# EAGLE design Corner Board Rev4updated (EAGLE 9.6.2)

## Sheet 1 of 3
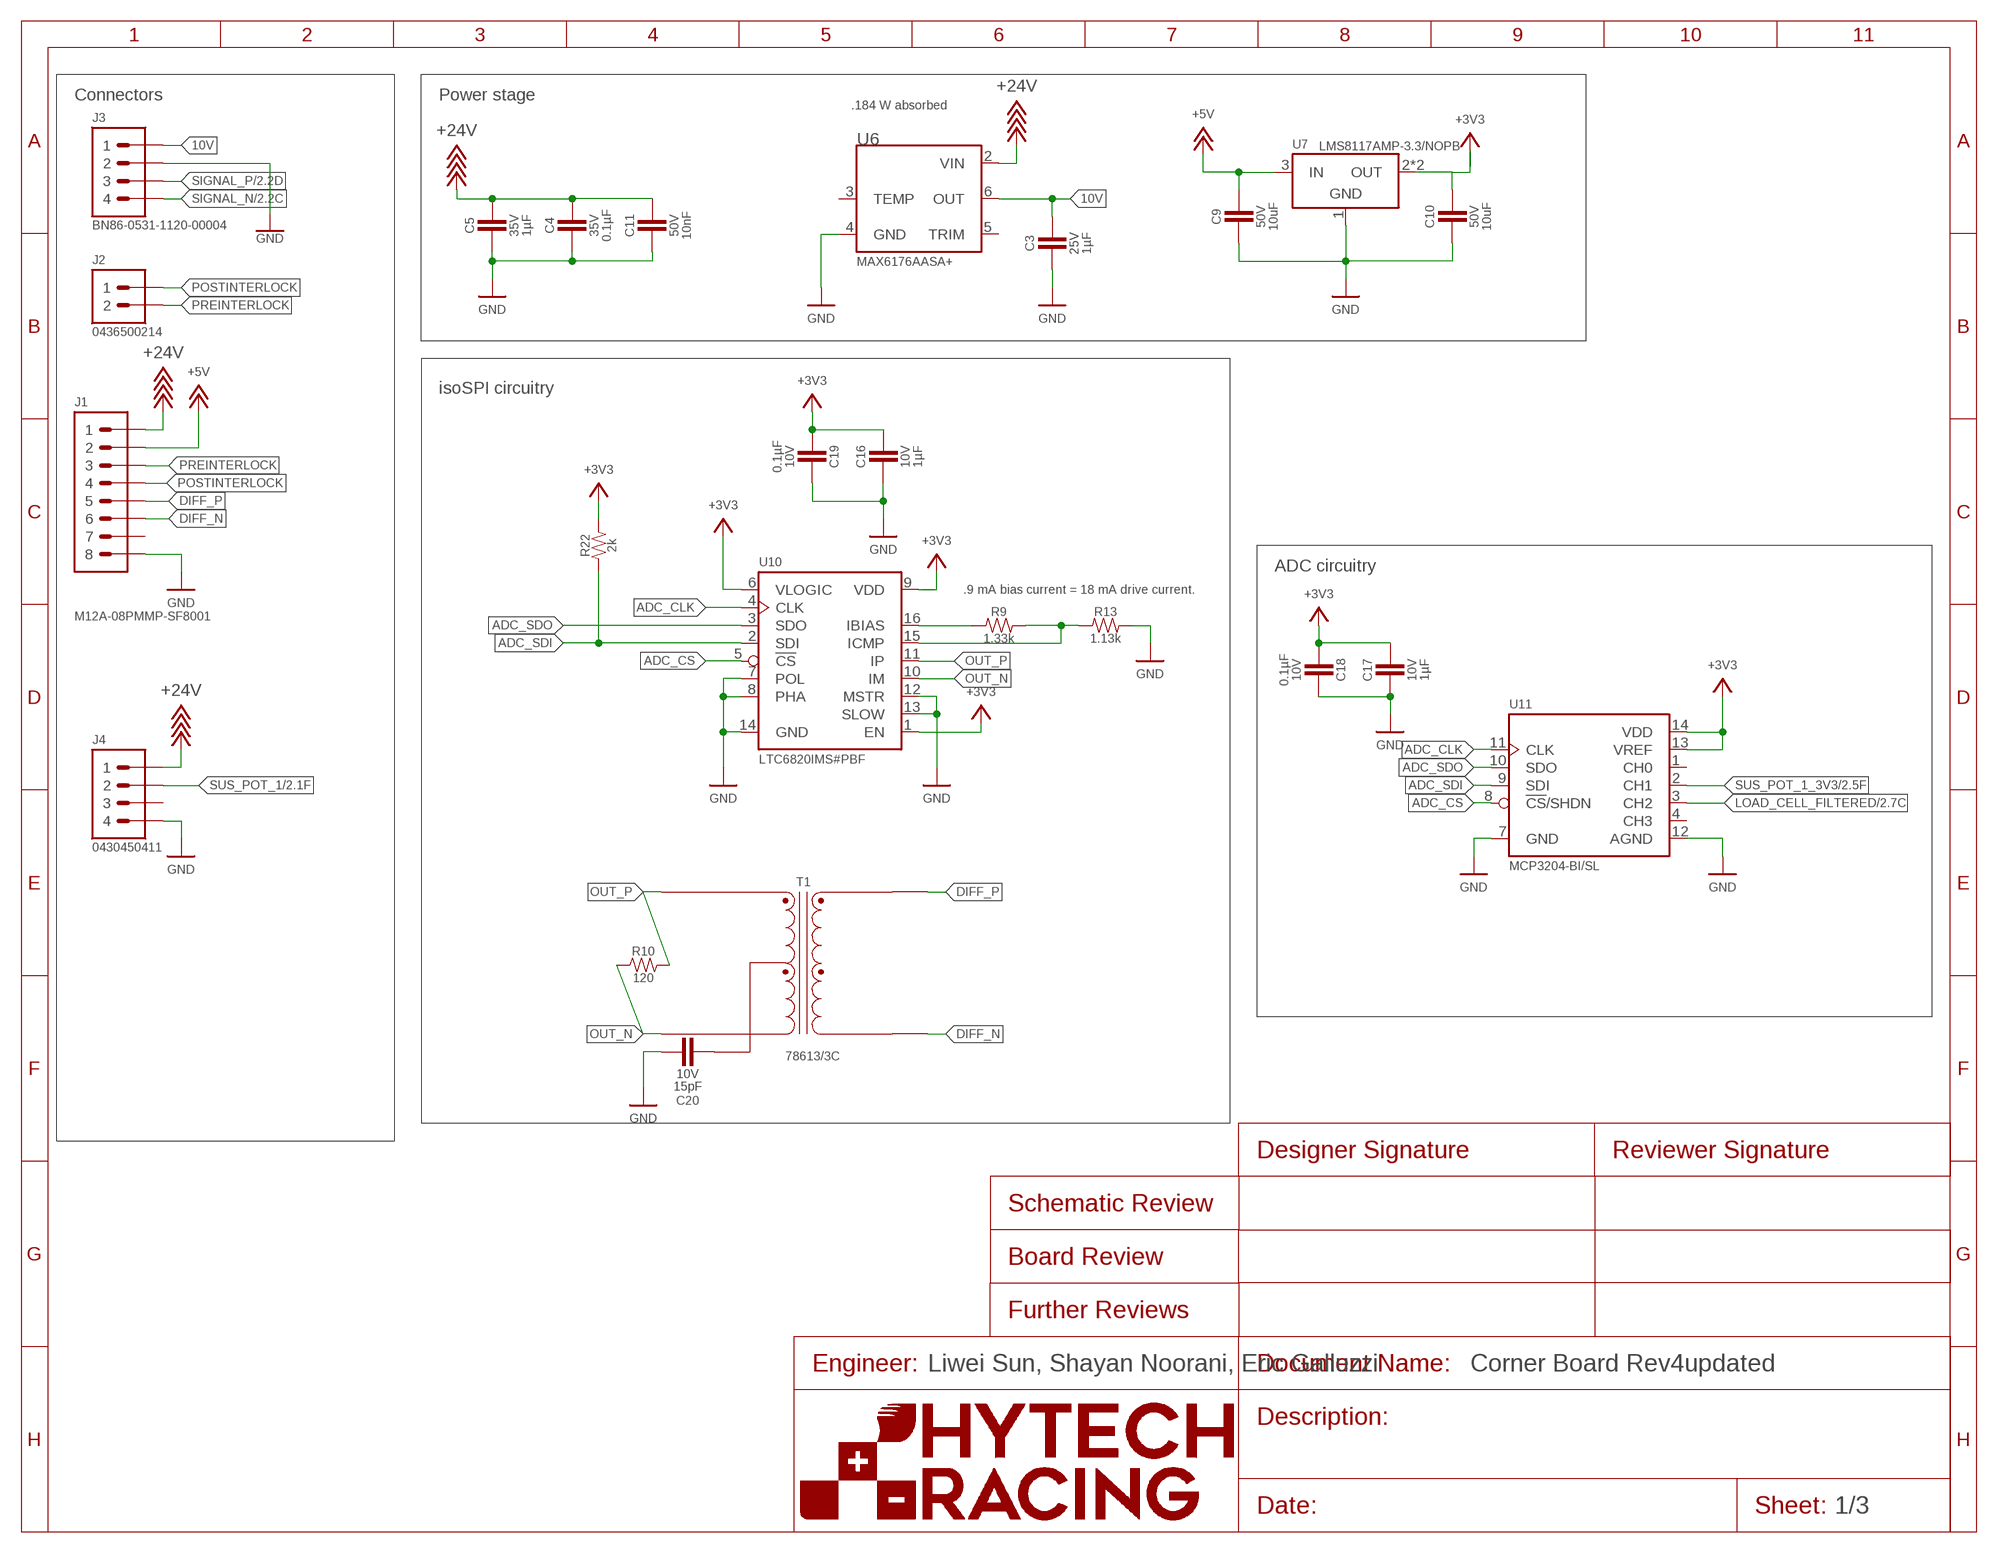
[diagram p0: schematic, sheet 1]
FRAME1 (FRAME): ENGINEER: Liwei Sun, Shayan Noorani, Eric Galluzzi

### Parts
C3  CAPACITOR_0603_25V_1UF  [0603-CAP]
C4  CAPACITOR_0603_35V_0.1UF  [0603-CAP]
C5  CAPACITOR_0603_35V_1UF  [0603-CAP]
C9  CAPACITOR_0805_50V_10UF  [0805-CAP]
C10  CAPACITOR_0805_50V_10UF  [0805-CAP]
C11  CAPACITOR_0603_50V_10NF  [0603-CAP]
C16  CAPACITOR_0603_10V_1UF  [0603-CAP]
C17  CAPACITOR_0603_10V_1UF  [0603-CAP]
C18  CAPACITOR_0603_10V_0.1UF  [0603-CAP]
C19  CAPACITOR_0603_10V_0.1UF  [0603-CAP]
C20  CAPACITOR_0603_10V_15PF  [0603-CAP]
J1  CONNECTOR-8_AMPHENOL_M12A_08PMMP_  [M12A-08PMMP]
J2  CONNECTOR-2_MICROFIT_SMD_RIGHTANGLE_02_SINGLE_BLACK  [MOLEX_MICROFIT_SMD_RIGHTANGLE_02_SINGLE]
J3  BINDER-M12-A_4_PIN  [BINDER-86-0531-1120-00004M12]
J4  CONNECTOR-4_μF_S_RA_  [MOLEX_MICROFIT_SMD_RIGHTANGLE_04_DUAL]
R9  RESISTOR_0603_1.33K  [0603-RES]
R10  RESISTOR_0603_120  [0603-RES]
R13  RESISTOR_0603_1.13K  [0603-RES]
R22  RESISTOR_0603_2K  [0603-RES]
T1  78613/3C_78613/3C_AIRGAP  [78613/3C_AIRGAP]
U6  VOLTAGE_REFERENCE_SOIC-8_10V  [SOIC-08(NARROW,0.15")]
U7  VOLTAGE_REGULATOR_SOT-223_3.3V  [SOT-223]
U10  LTC6820  [MSOP-16]
U11  MCP3204  [SOIC-14]

### Nets
10V: C3.1 J3.1 U6.6(OUT)
+3V3: C10.1 C16.1 C17.1 C18.2 C19.2 R22.2 U7.2(OUT) U7.4(OUT) U10.1(EN) U10.6(VLOGIC) U10.9(VDD) U11.13(VREF) U11.14(VDD) ; also sheet 2
+5V: C9.1 J1.2 U7.3(IN)
+24V: C4.1 C5.1 C11.1 J1.1 J4.1 U6.2(VIN) ; also sheet 2
ADC_CLK: U10.4(CLK) U11.11(CLK)
ADC_CS: U10.5(!CS) U11.8(!CS!/SHDN)
ADC_SDI: R22.1 U10.2(SDI) U11.9(SDI)
ADC_SDO: U10.3(SDO) U11.10(SDO)
DIFF_N: J1.6 T1.4(SEC_1)
DIFF_P: J1.5 T1.6(SEC_2)
GND: C3.2 C4.2 C5.2 C9.2 C10.2 C11.2 C16.2 C17.2 C18.1 C19.1 C20.2 J1.8 J3.2 J4.4 R13.2 U6.4(GND) U7.1(GND) U10.7(POL) U10.8(PHA) U10.12(MSTR) U10.13(SLOW) U10.14(GND) U11.7(GND) U11.12(AGND) ; also sheet 2
LOAD_CELL_FILTERED: U11.3(CH2) ; also sheet 2
N$14: C20.1 T1.2(PRI_CENTER_TAP)
N$16: R9.1 U10.16(IBIAS)
N$17: R9.2 R13.1 U10.15(ICMP)
OUT_N: R10.1 T1.3(PRI_2) U10.10(IM)
OUT_P: R10.2 T1.1(PRI_1) U10.11(IP)
POSTINTERLOCK: J1.4 J2.1
PREINTERLOCK: J1.3 J2.2
SIGNAL_N: J3.4 ; also sheet 2
SIGNAL_P: J3.3 ; also sheet 2
SUS_POT_1: J4.2 ; also sheet 2
SUS_POT_1_3V3: U11.2(CH1) ; also sheet 2
Unconnected: J1.7 J4.3 U6.3(TEMP) U6.5(TRIM) U11.1(CH0) U11.4(CH3)

### Notes on the sheet
- Connectors | Power stage
- .184 W absorbed
- isoSPI circuitry
- ADC circuitry
- .9 mA bias current = 18 mA drive current.

## Sheet 2 of 3: Signal Aq
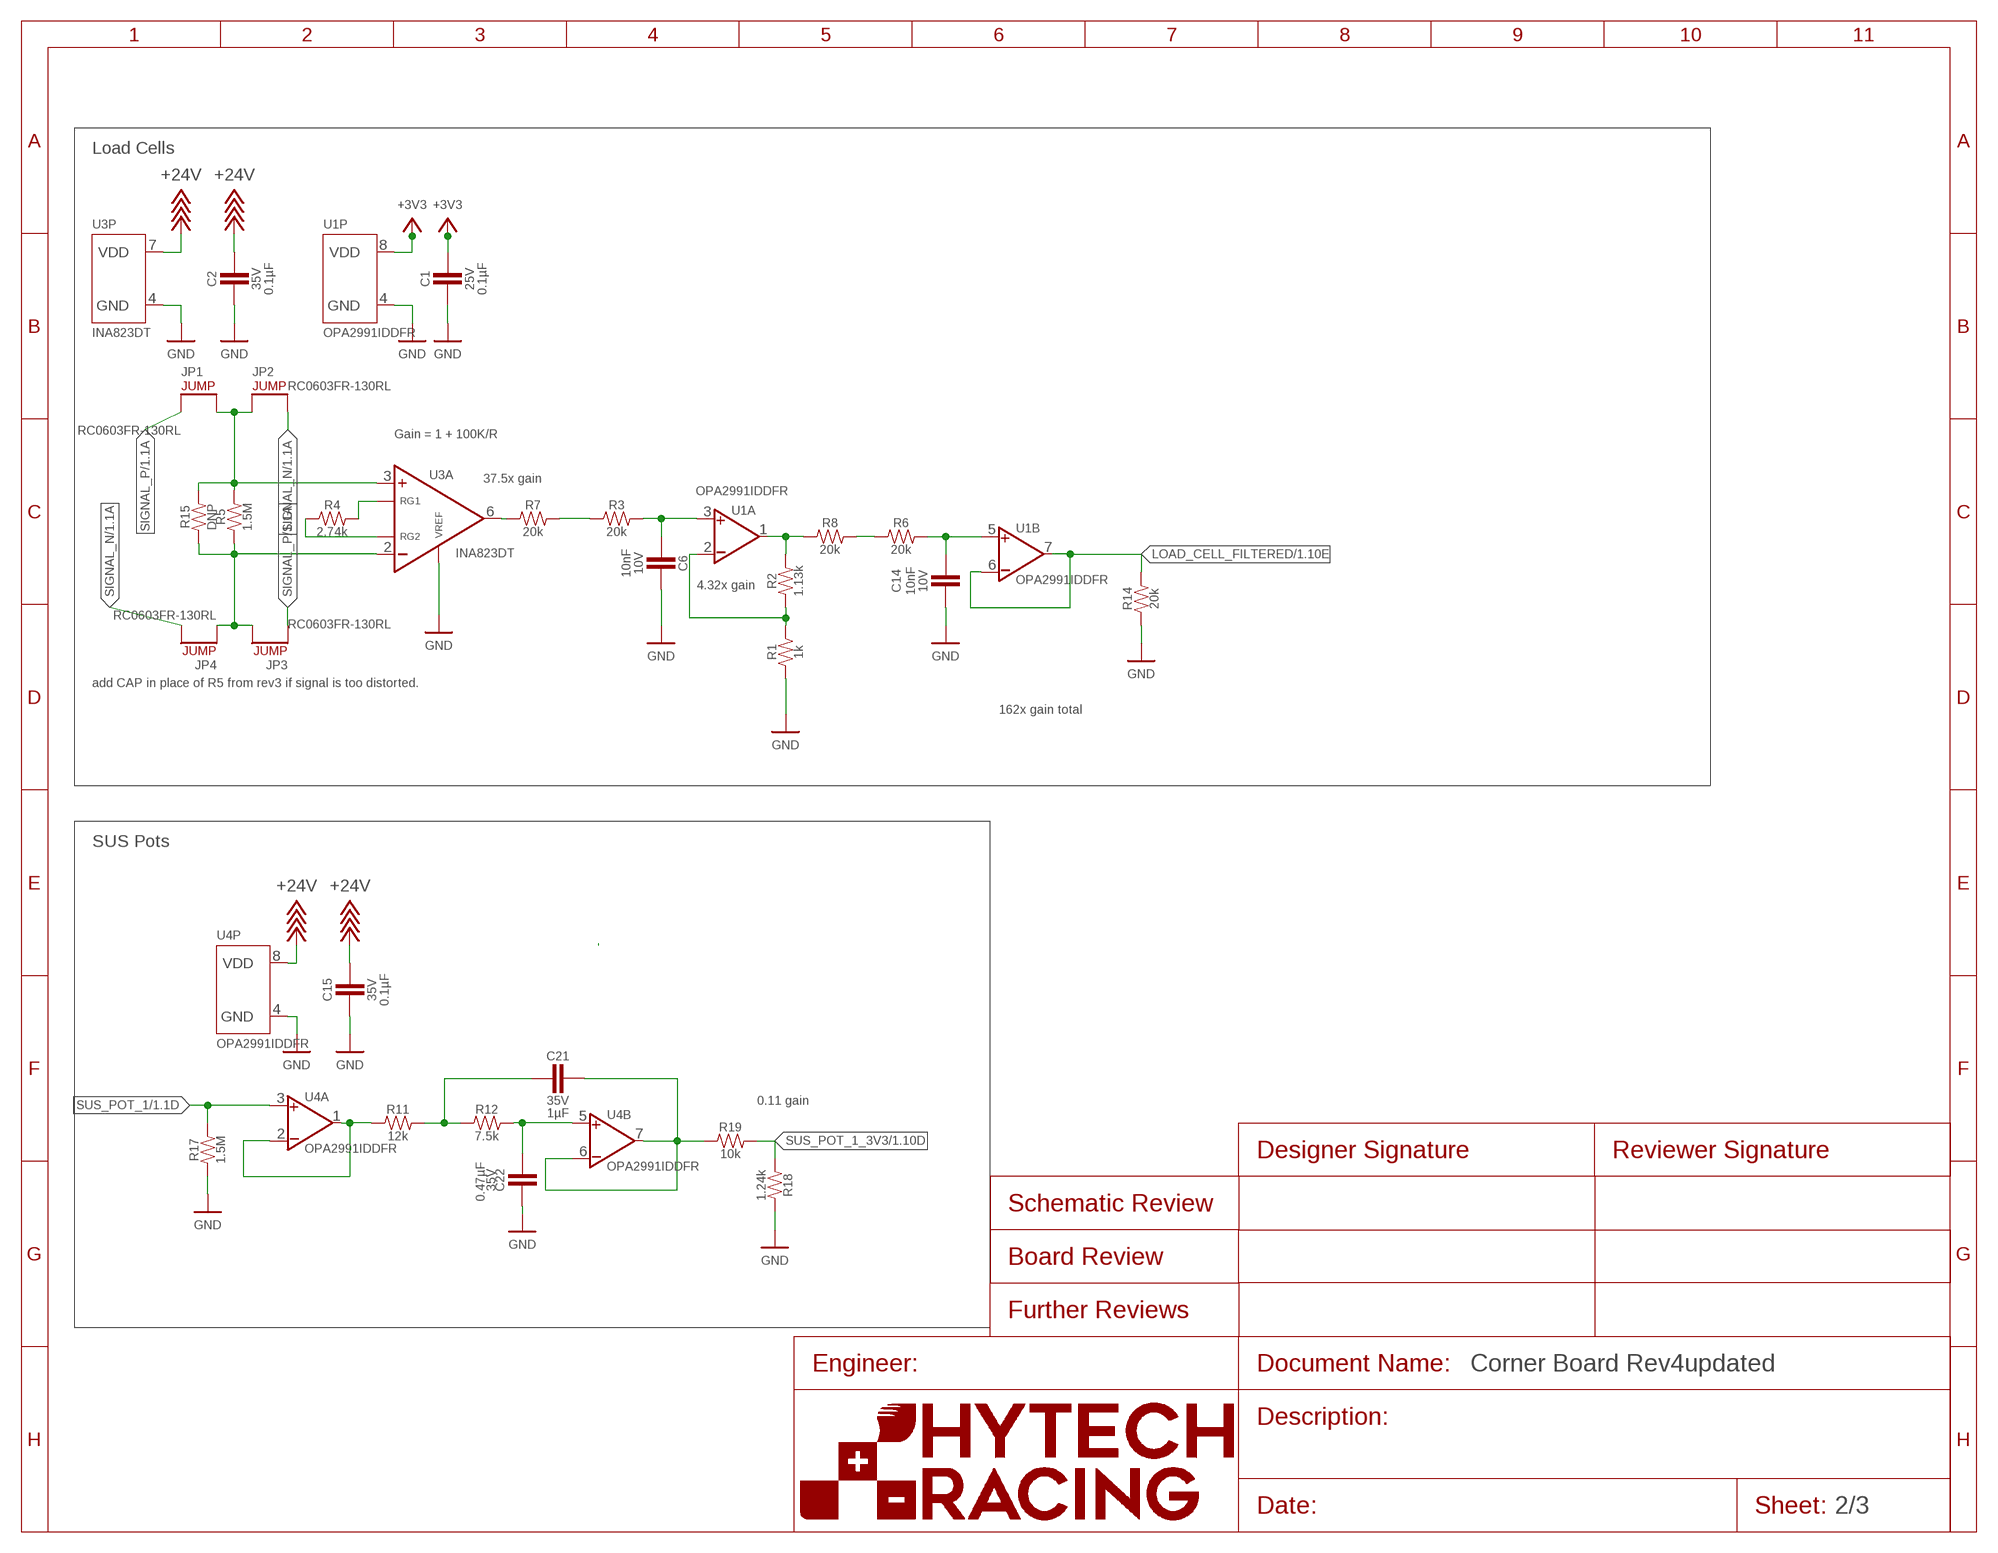
[diagram p1: schematic, sheet 2]

### Parts
C1  CAPACITOR_0603_25V_0.1UF  [0603-CAP]
C2  CAPACITOR_0603_35V_0.1UF  [0603-CAP]
C6  CAPACITOR_0603_10V_10NF  [0603-CAP]
C14  CAPACITOR_0603_10V_10NF  [0603-CAP]
C15  CAPACITOR_0603_35V_0.1UF  [0603-CAP]
C21  CAPACITOR_0603_35V_1UF  [0603-CAP]
C22  CAPACITOR_0603_35V_0.47UF  [0603-CAP]
JP1  JUMPER_0603_  [0603-RES]
JP2  JUMPER_0603_  [0603-RES]
JP3  JUMPER_0603_  [0603-RES]
JP4  JUMPER_0603_  [0603-RES]
R1  RESISTOR_0603_1K  [0603-RES]
R2  RESISTOR_0603_1.13K  [0603-RES]
R3  RESISTOR_0603_20K  [0603-RES]
R4  RESISTOR_0603_2.74K  [0603-RES]
R5  RESISTOR_0603_1.5M  [0603-RES]
R6  RESISTOR_0603_20K  [0603-RES]
R7  RESISTOR_0603_20K  [0603-RES]
R8  RESISTOR_0603_20K  [0603-RES]
R11  RESISTOR_0603_12K  [0603-RES]
R12  RESISTOR_0603_7.5K  [0603-RES]
R14  RESISTOR_0603_20K  [0603-RES]
R15  RESISTOR_0603_DNP  [0603-RES]
R17  RESISTOR_0603_1.5M  [0603-RES]
R18  RESISTOR_0603_1.24K  [0603-RES]
R19  RESISTOR_0603_10K  [0603-RES]
U1  OPAMP_2_CHANNEL_OPA_2991  [SOT-23-8]
U3  INA823DT  [SOIC-08(NARROW,0.15")]
U4  OPAMP_2_CHANNEL_OPA_2991  [SOT-23-8]

### Nets
+3V3: C1.1 U1.8(P:VDD) ; also sheet 1
+24V: C2.1 C15.1 U3.7(P:VDD) U4.8(P:VDD) ; also sheet 1
GND: C1.2 C2.2 C6.1 C14.1 C15.2 C22.2 R1.1 R14.1 R17.1 R18.2 U1.4(P:GND) U3.4(P:GND) U3.5(A:VREF) U4.4(P:GND) ; also sheet 1
LOAD_CELL_AMPLIFIED: R2.2 R8.1 U1.1(A:VOUT)
LOAD_CELL_FILTERED: R14.2 U1.6(B:VIN-) U1.7(B:VOUT) ; also sheet 1
LOAD_CELL_POST_INA: R7.1 U3.6(A:VOUT)
N$1: R1.2 R2.1 U1.2(A:VIN-)
N$2: R4.2 U3.1(A:RG1)
N$3: R3.1 R7.2
N$4: R4.1 U3.8(A:RG2)
N$6: C6.2 R3.2 U1.3(A:VIN+)
N$7: JP3.2 JP4.1 R5.1 R15.1 U3.2(A:VIN-)
N$8: R6.1 R8.2
N$9: JP1.2 JP2.1 R5.2 R15.2 U3.3(A:VIN+)
N$10: C14.2 R6.2 U1.5(B:VIN+)
N$22: C21.1 R19.1 U4.6(B:VIN-) U4.7(B:VOUT)
N$49: C22.1 R12.2 U4.5(B:VIN+)
N$53: C21.2 R11.2 R12.1
SIGNAL_N: JP2.2 JP4.2 ; also sheet 1
SIGNAL_P: JP1.1 JP3.1 ; also sheet 1
SUS_POT_1: R17.2 U4.3(A:VIN+) ; also sheet 1
SUS_POT_1_3V3: R18.1 R19.2 ; also sheet 1
SUS_POT_1_24V1: R11.1 U4.1(A:VOUT) U4.2(A:VIN-)

### Notes on the sheet
- Load Cells
- Gain = 1 + 100K/R
- 37.5x gain
- 4.32x gain
- add CAP in place of R5 from rev3 if signal is too distorted.
- 162x gain total
- SUS Pots
- 0.11 gain

## Sheet 3 of 3
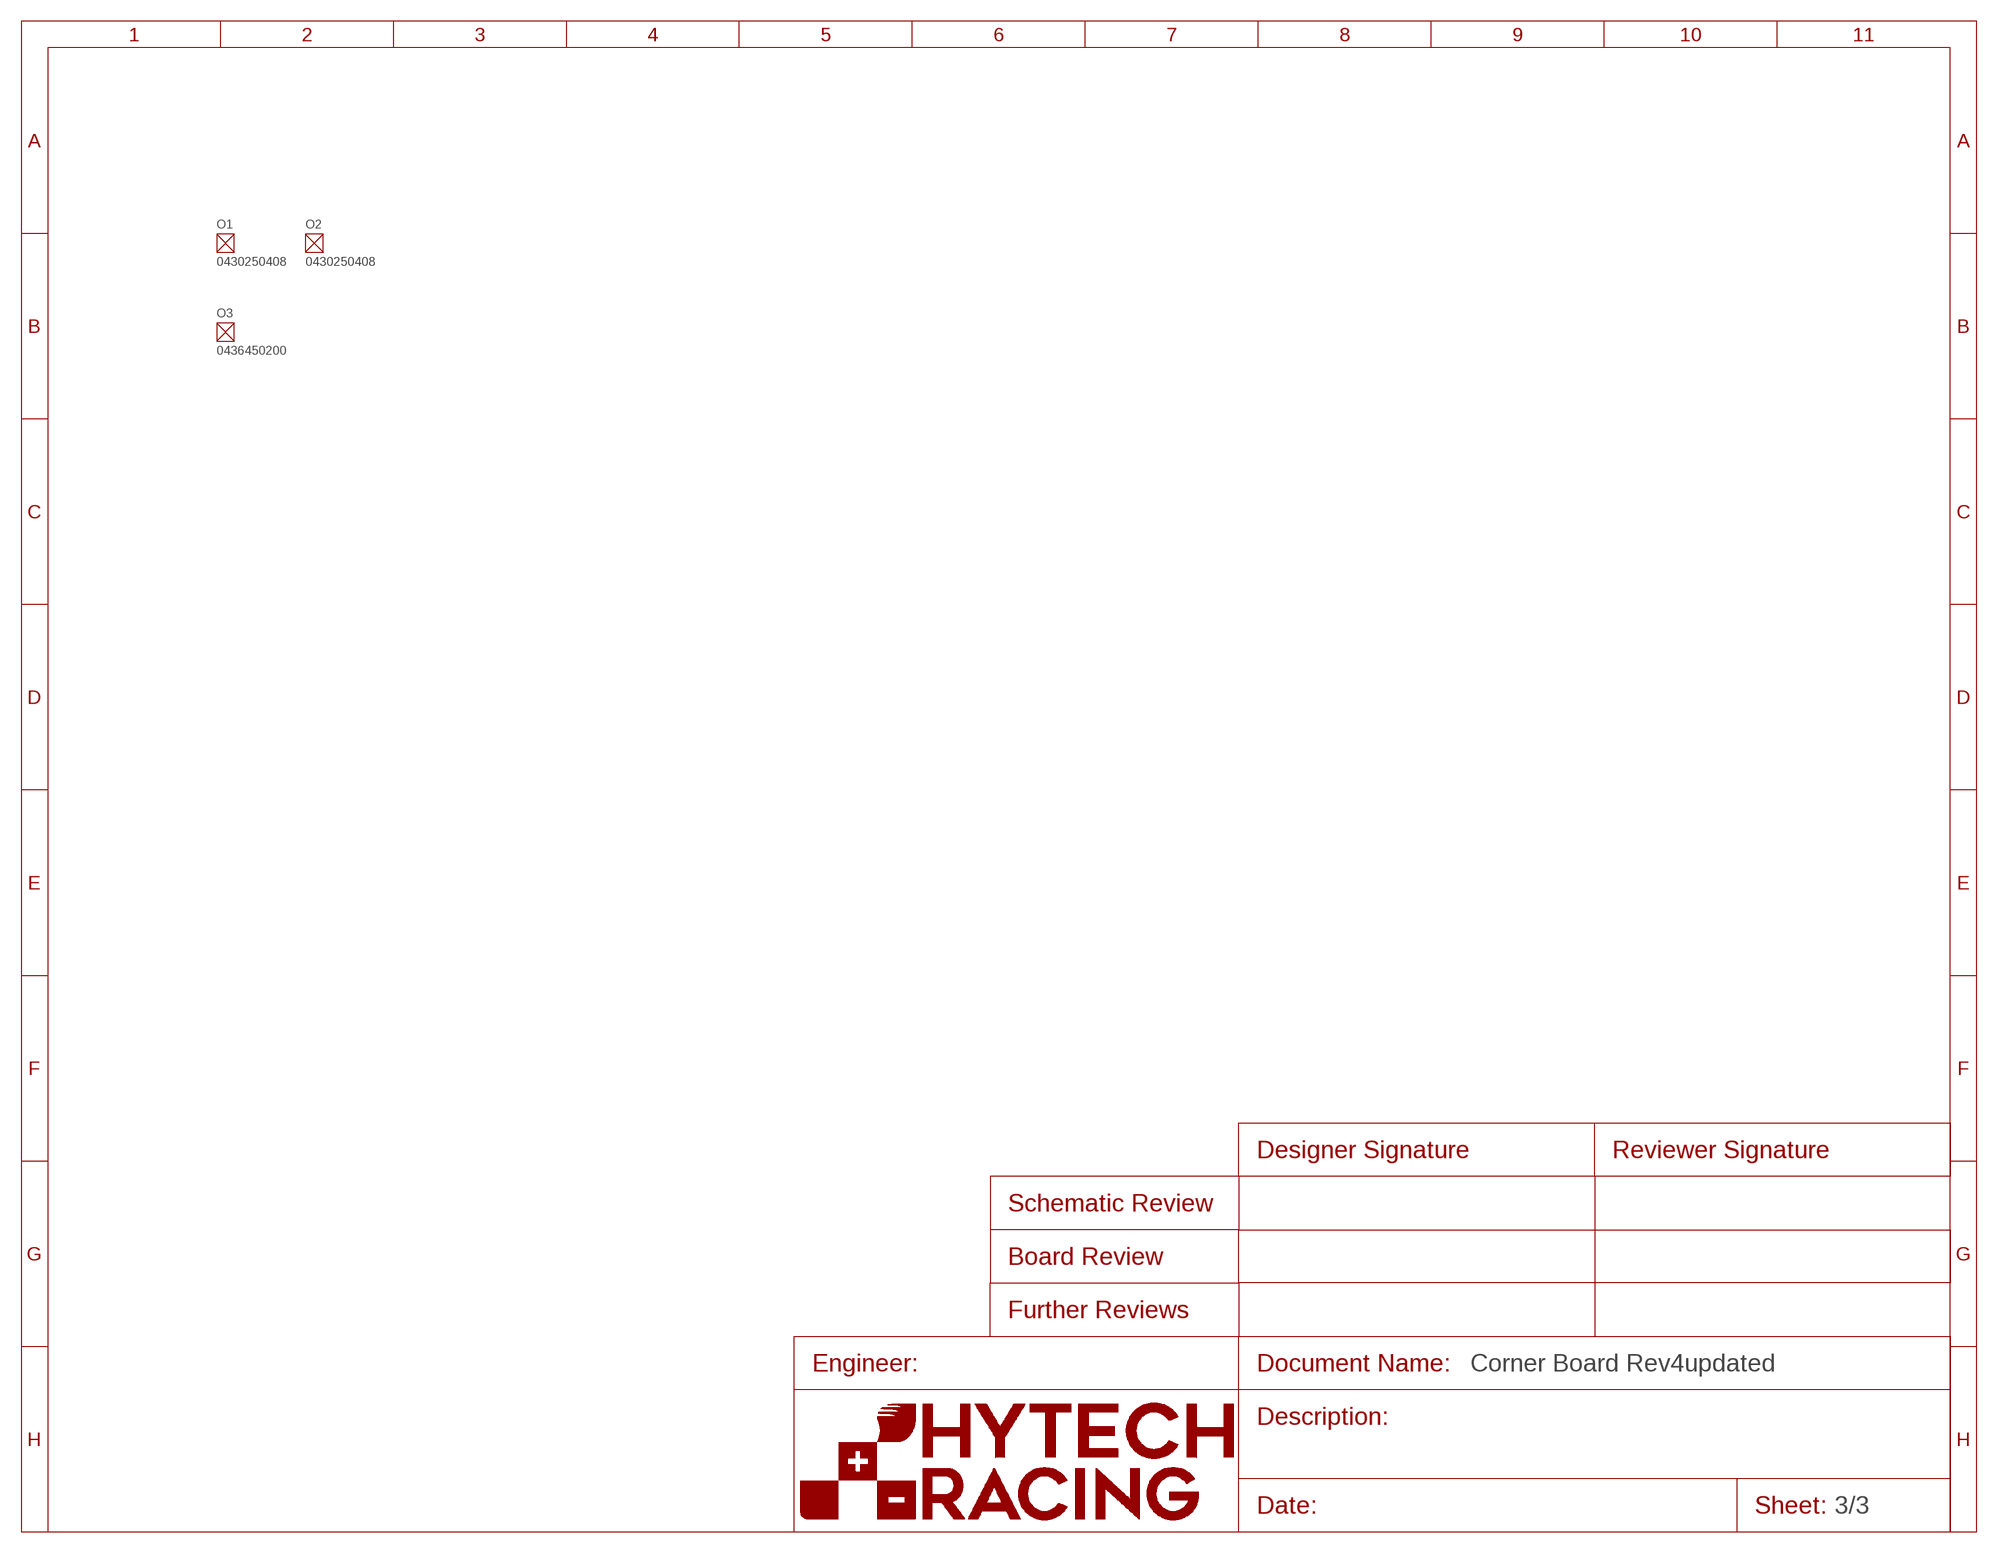
[diagram p2: schematic, sheet 3]
O1 (RECEPTACLE-4_MICROFIT): DKPN: WM11225-ND; MANUFACTURER: Molex; MOPN: 538-43025-0408; MPN: 0430250408
O2 (RECEPTACLE-4_MICROFIT): DKPN: WM11225-ND; MANUFACTURER: Molex; MOPN: 538-43025-0408; MPN: 0430250408
O3 (RECEPTACLE-2_MICROFIT): DKPN: WM1845-ND; MANUFACTURER: Molex; MOPN: 538-43645-0200; MPN: 0436450200

## Library data of the parts
C1 = HyTechDevices:CAPACITOR_?_*: Capacitor, Non-Polarized VJ...1BC Series Datasheet <https://www.mouser.com/datasheet/2/427/vjw1bcbascomseries-1762447.pdf> Samsung Datasheet <https://www.mouser.com/datasheet/2/585/MLCC-1837944.pdf> Samsung Automotive MLCC Datasheet <https://www.mouser.com/datasheet/2/585/MLCC_Automotive-1837966.pdf> Walsin Datasheet <https://www.mouser.com/datasheet/2/210/WTC_MLCC_General_Purpose-1534899.pdf> GRM188R61A226ME15D <https://www.mouser.com/datasheet/2/281/1/GRM188R61A226ME15_02A-1985787.pdf> GRM188R61E106MA73D <https://www.mouser.com/datasheet/2/281/1/GRM188R61E106MA73_01A-1985806.pdf> 885012006013 <https://www.mouser.com/datasheet/2/445/885012006013-1726946.pdf> 2220Y6300105KXTWS2 <https://www.mouser.com/datasheet/2/218/SMD_High_and_Std_StackiCap_P62-1825512.pdf> Yageo Class 2, X5R <https://www.mouser.com/datasheet/2/447/UPY_GPHC_X5R_4V_to_50V_26-1827097.pdf> TDK C Series <https://www.mouser.com/ProductDetail/TDK/C3216X5R1V226M160AC?qs=%2Fha2pyFadujbcx9jh7lYl%2F4NeMoXFhdc8AqVWNq4wW6M2y7zl6GzBuhgtI0ngznN> AVX Automotive MLCC <https://www.mouser.com/datasheet/2/40/AutoMLCC-777028.pdf> KEMET X7R Series <https://www.mouser.com/datasheet/2/212/KEM_C1002_X7R_SMD-1102033.pdf> Kyocera AVX <https://www.mouser.com/datasheet/2/40/C0GNP0_Dielectric-951274.pdf> GRM21BR61H <https://www.mouser.com/datasheet/2/281/1/GRM21BR61H106KE43_01A-1986884.pdf> C1812W104KDRACTU <https://www.mouser.com/datasheet/2/212/KEM_C1034_X7R_HV_ARC_SMD-1101730.pdf> CGA series - MLCC Automotive grade <https://product.tdk.com/system/files/dam/doc/product/capacitor/ceramic/mlcc/catalog/mlcc_automotive_general_en.pdf> TDK C Series Data Sheet <https://product.tdk.com/system/files/dam/doc/product/capacitor/ceramic/mlcc/catalog/mlcc_commercial_general_en.pdf> Kemet Datasheet <https://connect.kemet.com:7667/gateway/IntelliData-ComponentDocumentation/1.0/download/datasheet/C0603C220K3RACAUTO>; CAPACITANCE: 0.1µF; DKPN: 1276-1006-1-ND; MANUFACTURER: Samsung Electro-Mechanics; MOPN: 187-CL10B104KA8NNNC; MPN: CL10B104KA8NNNC; TOLERANCE: 10%; VOLTAGE: 25V
C2 C4 C15 = HyTechDevices:CAPACITOR_?_*: Capacitor, Non-Polarized VJ...1BC Series Datasheet <https://www.mouser.com/datasheet/2/427/vjw1bcbascomseries-1762447.pdf> Samsung Datasheet <https://www.mouser.com/datasheet/2/585/MLCC-1837944.pdf> Samsung Automotive MLCC Datasheet <https://www.mouser.com/datasheet/2/585/MLCC_Automotive-1837966.pdf> Walsin Datasheet <https://www.mouser.com/datasheet/2/210/WTC_MLCC_General_Purpose-1534899.pdf> GRM188R61A226ME15D <https://www.mouser.com/datasheet/2/281/1/GRM188R61A226ME15_02A-1985787.pdf> GRM188R61E106MA73D <https://www.mouser.com/datasheet/2/281/1/GRM188R61E106MA73_01A-1985806.pdf> 885012006013 <https://www.mouser.com/datasheet/2/445/885012006013-1726946.pdf> 2220Y6300105KXTWS2 <https://www.mouser.com/datasheet/2/218/SMD_High_and_Std_StackiCap_P62-1825512.pdf> Yageo Class 2, X5R <https://www.mouser.com/datasheet/2/447/UPY_GPHC_X5R_4V_to_50V_26-1827097.pdf> TDK C Series <https://www.mouser.com/ProductDetail/TDK/C3216X5R1V226M160AC?qs=%2Fha2pyFadujbcx9jh7lYl%2F4NeMoXFhdc8AqVWNq4wW6M2y7zl6GzBuhgtI0ngznN> AVX Automotive MLCC <https://www.mouser.com/datasheet/2/40/AutoMLCC-777028.pdf> KEMET X7R Series <https://www.mouser.com/datasheet/2/212/KEM_C1002_X7R_SMD-1102033.pdf> Kyocera AVX <https://www.mouser.com/datasheet/2/40/C0GNP0_Dielectric-951274.pdf> GRM21BR61H <https://www.mouser.com/datasheet/2/281/1/GRM21BR61H106KE43_01A-1986884.pdf> C1812W104KDRACTU <https://www.mouser.com/datasheet/2/212/KEM_C1034_X7R_HV_ARC_SMD-1101730.pdf> CGA series - MLCC Automotive grade <https://product.tdk.com/system/files/dam/doc/product/capacitor/ceramic/mlcc/catalog/mlcc_automotive_general_en.pdf> TDK C Series Data Sheet <https://product.tdk.com/system/files/dam/doc/product/capacitor/ceramic/mlcc/catalog/mlcc_commercial_general_en.pdf> Kemet Datasheet <https://connect.kemet.com:7667/gateway/IntelliData-ComponentDocumentation/1.0/download/datasheet/C0603C220K3RACAUTO>; CAPACITANCE: 0.1µF; DKPN: 587-3354-1-ND; MANUFACTURER: Taiyo Yuden; MOPN: 963-GMK107B7104KAHT; MPN: GMK107B7104KAHT; TOLERANCE: 10%; VOLTAGE: 35V
C3 = HyTechDevices:CAPACITOR_?_*: Capacitor, Non-Polarized VJ...1BC Series Datasheet <https://www.mouser.com/datasheet/2/427/vjw1bcbascomseries-1762447.pdf> Samsung Datasheet <https://www.mouser.com/datasheet/2/585/MLCC-1837944.pdf> Samsung Automotive MLCC Datasheet <https://www.mouser.com/datasheet/2/585/MLCC_Automotive-1837966.pdf> Walsin Datasheet <https://www.mouser.com/datasheet/2/210/WTC_MLCC_General_Purpose-1534899.pdf> GRM188R61A226ME15D <https://www.mouser.com/datasheet/2/281/1/GRM188R61A226ME15_02A-1985787.pdf> GRM188R61E106MA73D <https://www.mouser.com/datasheet/2/281/1/GRM188R61E106MA73_01A-1985806.pdf> 885012006013 <https://www.mouser.com/datasheet/2/445/885012006013-1726946.pdf> 2220Y6300105KXTWS2 <https://www.mouser.com/datasheet/2/218/SMD_High_and_Std_StackiCap_P62-1825512.pdf> Yageo Class 2, X5R <https://www.mouser.com/datasheet/2/447/UPY_GPHC_X5R_4V_to_50V_26-1827097.pdf> TDK C Series <https://www.mouser.com/ProductDetail/TDK/C3216X5R1V226M160AC?qs=%2Fha2pyFadujbcx9jh7lYl%2F4NeMoXFhdc8AqVWNq4wW6M2y7zl6GzBuhgtI0ngznN> AVX Automotive MLCC <https://www.mouser.com/datasheet/2/40/AutoMLCC-777028.pdf> KEMET X7R Series <https://www.mouser.com/datasheet/2/212/KEM_C1002_X7R_SMD-1102033.pdf> Kyocera AVX <https://www.mouser.com/datasheet/2/40/C0GNP0_Dielectric-951274.pdf> GRM21BR61H <https://www.mouser.com/datasheet/2/281/1/GRM21BR61H106KE43_01A-1986884.pdf> C1812W104KDRACTU <https://www.mouser.com/datasheet/2/212/KEM_C1034_X7R_HV_ARC_SMD-1101730.pdf> CGA series - MLCC Automotive grade <https://product.tdk.com/system/files/dam/doc/product/capacitor/ceramic/mlcc/catalog/mlcc_automotive_general_en.pdf> TDK C Series Data Sheet <https://product.tdk.com/system/files/dam/doc/product/capacitor/ceramic/mlcc/catalog/mlcc_commercial_general_en.pdf> Kemet Datasheet <https://connect.kemet.com:7667/gateway/IntelliData-ComponentDocumentation/1.0/download/datasheet/C0603C220K3RACAUTO>; CAPACITANCE: 1µF; DKPN: 1276-1184-1-ND; MANUFACTURER: Samsung Electro-Mechanics; MOPN: 187-CL10B105KA8NNNC; MPN: CL10B105KA8NNNC; TOLERANCE: 10%; VOLTAGE: 25V
C5 C21 = HyTechDevices:CAPACITOR_?_*: Capacitor, Non-Polarized VJ...1BC Series Datasheet <https://www.mouser.com/datasheet/2/427/vjw1bcbascomseries-1762447.pdf> Samsung Datasheet <https://www.mouser.com/datasheet/2/585/MLCC-1837944.pdf> Samsung Automotive MLCC Datasheet <https://www.mouser.com/datasheet/2/585/MLCC_Automotive-1837966.pdf> Walsin Datasheet <https://www.mouser.com/datasheet/2/210/WTC_MLCC_General_Purpose-1534899.pdf> GRM188R61A226ME15D <https://www.mouser.com/datasheet/2/281/1/GRM188R61A226ME15_02A-1985787.pdf> GRM188R61E106MA73D <https://www.mouser.com/datasheet/2/281/1/GRM188R61E106MA73_01A-1985806.pdf> 885012006013 <https://www.mouser.com/datasheet/2/445/885012006013-1726946.pdf> 2220Y6300105KXTWS2 <https://www.mouser.com/datasheet/2/218/SMD_High_and_Std_StackiCap_P62-1825512.pdf> Yageo Class 2, X5R <https://www.mouser.com/datasheet/2/447/UPY_GPHC_X5R_4V_to_50V_26-1827097.pdf> TDK C Series <https://www.mouser.com/ProductDetail/TDK/C3216X5R1V226M160AC?qs=%2Fha2pyFadujbcx9jh7lYl%2F4NeMoXFhdc8AqVWNq4wW6M2y7zl6GzBuhgtI0ngznN> AVX Automotive MLCC <https://www.mouser.com/datasheet/2/40/AutoMLCC-777028.pdf> KEMET X7R Series <https://www.mouser.com/datasheet/2/212/KEM_C1002_X7R_SMD-1102033.pdf> Kyocera AVX <https://www.mouser.com/datasheet/2/40/C0GNP0_Dielectric-951274.pdf> GRM21BR61H <https://www.mouser.com/datasheet/2/281/1/GRM21BR61H106KE43_01A-1986884.pdf> C1812W104KDRACTU <https://www.mouser.com/datasheet/2/212/KEM_C1034_X7R_HV_ARC_SMD-1101730.pdf> CGA series - MLCC Automotive grade <https://product.tdk.com/system/files/dam/doc/product/capacitor/ceramic/mlcc/catalog/mlcc_automotive_general_en.pdf> TDK C Series Data Sheet <https://product.tdk.com/system/files/dam/doc/product/capacitor/ceramic/mlcc/catalog/mlcc_commercial_general_en.pdf> Kemet Datasheet <https://connect.kemet.com:7667/gateway/IntelliData-ComponentDocumentation/1.0/download/datasheet/C0603C220K3RACAUTO>; CAPACITANCE: 1µF; DKPN: 445-173625-1-ND; MANUFACTURER: TDK Corporation; MOPN: 810-C1608X7R1V105KAE; MPN: C1608X7R1V105K080AE; TOLERANCE: 10%; VOLTAGE: 35V
C6 C14 = HyTechDevices:CAPACITOR_?_*: Capacitor, Non-Polarized VJ...1BC Series Datasheet <https://www.mouser.com/datasheet/2/427/vjw1bcbascomseries-1762447.pdf> Samsung Datasheet <https://www.mouser.com/datasheet/2/585/MLCC-1837944.pdf> Samsung Automotive MLCC Datasheet <https://www.mouser.com/datasheet/2/585/MLCC_Automotive-1837966.pdf> Walsin Datasheet <https://www.mouser.com/datasheet/2/210/WTC_MLCC_General_Purpose-1534899.pdf> GRM188R61A226ME15D <https://www.mouser.com/datasheet/2/281/1/GRM188R61A226ME15_02A-1985787.pdf> GRM188R61E106MA73D <https://www.mouser.com/datasheet/2/281/1/GRM188R61E106MA73_01A-1985806.pdf> 885012006013 <https://www.mouser.com/datasheet/2/445/885012006013-1726946.pdf> 2220Y6300105KXTWS2 <https://www.mouser.com/datasheet/2/218/SMD_High_and_Std_StackiCap_P62-1825512.pdf> Yageo Class 2, X5R <https://www.mouser.com/datasheet/2/447/UPY_GPHC_X5R_4V_to_50V_26-1827097.pdf> TDK C Series <https://www.mouser.com/ProductDetail/TDK/C3216X5R1V226M160AC?qs=%2Fha2pyFadujbcx9jh7lYl%2F4NeMoXFhdc8AqVWNq4wW6M2y7zl6GzBuhgtI0ngznN> AVX Automotive MLCC <https://www.mouser.com/datasheet/2/40/AutoMLCC-777028.pdf> KEMET X7R Series <https://www.mouser.com/datasheet/2/212/KEM_C1002_X7R_SMD-1102033.pdf> Kyocera AVX <https://www.mouser.com/datasheet/2/40/C0GNP0_Dielectric-951274.pdf> GRM21BR61H <https://www.mouser.com/datasheet/2/281/1/GRM21BR61H106KE43_01A-1986884.pdf> C1812W104KDRACTU <https://www.mouser.com/datasheet/2/212/KEM_C1034_X7R_HV_ARC_SMD-1101730.pdf> CGA series - MLCC Automotive grade <https://product.tdk.com/system/files/dam/doc/product/capacitor/ceramic/mlcc/catalog/mlcc_automotive_general_en.pdf> TDK C Series Data Sheet <https://product.tdk.com/system/files/dam/doc/product/capacitor/ceramic/mlcc/catalog/mlcc_commercial_general_en.pdf> Kemet Datasheet <https://connect.kemet.com:7667/gateway/IntelliData-ComponentDocumentation/1.0/download/datasheet/C0603C220K3RACAUTO>; CAPACITANCE: 10nF; DKPN: 311-4054-1-ND; MANUFACTURER: Yageo; MOPN: 603-CC603KRX7R6BB103; MPN: CC0603KRX7R6BB103; TOLERANCE: 10%; VOLTAGE: 10V
C9 C10 = HyTechDevices:CAPACITOR_?_*: Capacitor, Non-Polarized VJ...1BC Series Datasheet <https://www.mouser.com/datasheet/2/427/vjw1bcbascomseries-1762447.pdf> Samsung Datasheet <https://www.mouser.com/datasheet/2/585/MLCC-1837944.pdf> Samsung Automotive MLCC Datasheet <https://www.mouser.com/datasheet/2/585/MLCC_Automotive-1837966.pdf> Walsin Datasheet <https://www.mouser.com/datasheet/2/210/WTC_MLCC_General_Purpose-1534899.pdf> GRM188R61A226ME15D <https://www.mouser.com/datasheet/2/281/1/GRM188R61A226ME15_02A-1985787.pdf> GRM188R61E106MA73D <https://www.mouser.com/datasheet/2/281/1/GRM188R61E106MA73_01A-1985806.pdf> 885012006013 <https://www.mouser.com/datasheet/2/445/885012006013-1726946.pdf> 2220Y6300105KXTWS2 <https://www.mouser.com/datasheet/2/218/SMD_High_and_Std_StackiCap_P62-1825512.pdf> Yageo Class 2, X5R <https://www.mouser.com/datasheet/2/447/UPY_GPHC_X5R_4V_to_50V_26-1827097.pdf> TDK C Series <https://www.mouser.com/ProductDetail/TDK/C3216X5R1V226M160AC?qs=%2Fha2pyFadujbcx9jh7lYl%2F4NeMoXFhdc8AqVWNq4wW6M2y7zl6GzBuhgtI0ngznN> AVX Automotive MLCC <https://www.mouser.com/datasheet/2/40/AutoMLCC-777028.pdf> KEMET X7R Series <https://www.mouser.com/datasheet/2/212/KEM_C1002_X7R_SMD-1102033.pdf> Kyocera AVX <https://www.mouser.com/datasheet/2/40/C0GNP0_Dielectric-951274.pdf> GRM21BR61H <https://www.mouser.com/datasheet/2/281/1/GRM21BR61H106KE43_01A-1986884.pdf> C1812W104KDRACTU <https://www.mouser.com/datasheet/2/212/KEM_C1034_X7R_HV_ARC_SMD-1101730.pdf> CGA series - MLCC Automotive grade <https://product.tdk.com/system/files/dam/doc/product/capacitor/ceramic/mlcc/catalog/mlcc_automotive_general_en.pdf> TDK C Series Data Sheet <https://product.tdk.com/system/files/dam/doc/product/capacitor/ceramic/mlcc/catalog/mlcc_commercial_general_en.pdf> Kemet Datasheet <https://connect.kemet.com:7667/gateway/IntelliData-ComponentDocumentation/1.0/download/datasheet/C0603C220K3RACAUTO>; CAPACITANCE: 10uF; DKPN: 490-18663-2-ND; MANUFACTURER: Murata; MOPN: 81-GRM21BR61H106KE3L; MPN: GRM21BR61H106KE43L; TOLERANCE: 10%; VOLTAGE: 50V
C11 = HyTechDevices:CAPACITOR_?_*: Capacitor, Non-Polarized VJ...1BC Series Datasheet <https://www.mouser.com/datasheet/2/427/vjw1bcbascomseries-1762447.pdf> Samsung Datasheet <https://www.mouser.com/datasheet/2/585/MLCC-1837944.pdf> Samsung Automotive MLCC Datasheet <https://www.mouser.com/datasheet/2/585/MLCC_Automotive-1837966.pdf> Walsin Datasheet <https://www.mouser.com/datasheet/2/210/WTC_MLCC_General_Purpose-1534899.pdf> GRM188R61A226ME15D <https://www.mouser.com/datasheet/2/281/1/GRM188R61A226ME15_02A-1985787.pdf> GRM188R61E106MA73D <https://www.mouser.com/datasheet/2/281/1/GRM188R61E106MA73_01A-1985806.pdf> 885012006013 <https://www.mouser.com/datasheet/2/445/885012006013-1726946.pdf> 2220Y6300105KXTWS2 <https://www.mouser.com/datasheet/2/218/SMD_High_and_Std_StackiCap_P62-1825512.pdf> Yageo Class 2, X5R <https://www.mouser.com/datasheet/2/447/UPY_GPHC_X5R_4V_to_50V_26-1827097.pdf> TDK C Series <https://www.mouser.com/ProductDetail/TDK/C3216X5R1V226M160AC?qs=%2Fha2pyFadujbcx9jh7lYl%2F4NeMoXFhdc8AqVWNq4wW6M2y7zl6GzBuhgtI0ngznN> AVX Automotive MLCC <https://www.mouser.com/datasheet/2/40/AutoMLCC-777028.pdf> KEMET X7R Series <https://www.mouser.com/datasheet/2/212/KEM_C1002_X7R_SMD-1102033.pdf> Kyocera AVX <https://www.mouser.com/datasheet/2/40/C0GNP0_Dielectric-951274.pdf> GRM21BR61H <https://www.mouser.com/datasheet/2/281/1/GRM21BR61H106KE43_01A-1986884.pdf> C1812W104KDRACTU <https://www.mouser.com/datasheet/2/212/KEM_C1034_X7R_HV_ARC_SMD-1101730.pdf> CGA series - MLCC Automotive grade <https://product.tdk.com/system/files/dam/doc/product/capacitor/ceramic/mlcc/catalog/mlcc_automotive_general_en.pdf> TDK C Series Data Sheet <https://product.tdk.com/system/files/dam/doc/product/capacitor/ceramic/mlcc/catalog/mlcc_commercial_general_en.pdf> Kemet Datasheet <https://connect.kemet.com:7667/gateway/IntelliData-ComponentDocumentation/1.0/download/datasheet/C0603C220K3RACAUTO>; CAPACITANCE: 10nF; DKPN: 445-7404-1-ND; MANUFACTURER: TDK Corporation; MOPN: 810-C1608C0G1H103J; MPN: C1608C0G1H103J080AA; TOLERANCE: 5%; VOLTAGE: 50V
C16 C17 = HyTechDevices:CAPACITOR_?_*: Capacitor, Non-Polarized VJ...1BC Series Datasheet <https://www.mouser.com/datasheet/2/427/vjw1bcbascomseries-1762447.pdf> Samsung Datasheet <https://www.mouser.com/datasheet/2/585/MLCC-1837944.pdf> Samsung Automotive MLCC Datasheet <https://www.mouser.com/datasheet/2/585/MLCC_Automotive-1837966.pdf> Walsin Datasheet <https://www.mouser.com/datasheet/2/210/WTC_MLCC_General_Purpose-1534899.pdf> GRM188R61A226ME15D <https://www.mouser.com/datasheet/2/281/1/GRM188R61A226ME15_02A-1985787.pdf> GRM188R61E106MA73D <https://www.mouser.com/datasheet/2/281/1/GRM188R61E106MA73_01A-1985806.pdf> 885012006013 <https://www.mouser.com/datasheet/2/445/885012006013-1726946.pdf> 2220Y6300105KXTWS2 <https://www.mouser.com/datasheet/2/218/SMD_High_and_Std_StackiCap_P62-1825512.pdf> Yageo Class 2, X5R <https://www.mouser.com/datasheet/2/447/UPY_GPHC_X5R_4V_to_50V_26-1827097.pdf> TDK C Series <https://www.mouser.com/ProductDetail/TDK/C3216X5R1V226M160AC?qs=%2Fha2pyFadujbcx9jh7lYl%2F4NeMoXFhdc8AqVWNq4wW6M2y7zl6GzBuhgtI0ngznN> AVX Automotive MLCC <https://www.mouser.com/datasheet/2/40/AutoMLCC-777028.pdf> KEMET X7R Series <https://www.mouser.com/datasheet/2/212/KEM_C1002_X7R_SMD-1102033.pdf> Kyocera AVX <https://www.mouser.com/datasheet/2/40/C0GNP0_Dielectric-951274.pdf> GRM21BR61H <https://www.mouser.com/datasheet/2/281/1/GRM21BR61H106KE43_01A-1986884.pdf> C1812W104KDRACTU <https://www.mouser.com/datasheet/2/212/KEM_C1034_X7R_HV_ARC_SMD-1101730.pdf> CGA series - MLCC Automotive grade <https://product.tdk.com/system/files/dam/doc/product/capacitor/ceramic/mlcc/catalog/mlcc_automotive_general_en.pdf> TDK C Series Data Sheet <https://product.tdk.com/system/files/dam/doc/product/capacitor/ceramic/mlcc/catalog/mlcc_commercial_general_en.pdf> Kemet Datasheet <https://connect.kemet.com:7667/gateway/IntelliData-ComponentDocumentation/1.0/download/datasheet/C0603C220K3RACAUTO>; CAPACITANCE: 1µF; DKPN: 311-1796-1-ND; MANUFACTURER: Yageo; MOPN: 603-CC603KRX7R6BB105; MPN: CC0603KRX7R6BB105; TOLERANCE: 10%; VOLTAGE: 10V
C18 C19 = HyTechDevices:CAPACITOR_?_*: Capacitor, Non-Polarized VJ...1BC Series Datasheet <https://www.mouser.com/datasheet/2/427/vjw1bcbascomseries-1762447.pdf> Samsung Datasheet <https://www.mouser.com/datasheet/2/585/MLCC-1837944.pdf> Samsung Automotive MLCC Datasheet <https://www.mouser.com/datasheet/2/585/MLCC_Automotive-1837966.pdf> Walsin Datasheet <https://www.mouser.com/datasheet/2/210/WTC_MLCC_General_Purpose-1534899.pdf> GRM188R61A226ME15D <https://www.mouser.com/datasheet/2/281/1/GRM188R61A226ME15_02A-1985787.pdf> GRM188R61E106MA73D <https://www.mouser.com/datasheet/2/281/1/GRM188R61E106MA73_01A-1985806.pdf> 885012006013 <https://www.mouser.com/datasheet/2/445/885012006013-1726946.pdf> 2220Y6300105KXTWS2 <https://www.mouser.com/datasheet/2/218/SMD_High_and_Std_StackiCap_P62-1825512.pdf> Yageo Class 2, X5R <https://www.mouser.com/datasheet/2/447/UPY_GPHC_X5R_4V_to_50V_26-1827097.pdf> TDK C Series <https://www.mouser.com/ProductDetail/TDK/C3216X5R1V226M160AC?qs=%2Fha2pyFadujbcx9jh7lYl%2F4NeMoXFhdc8AqVWNq4wW6M2y7zl6GzBuhgtI0ngznN> AVX Automotive MLCC <https://www.mouser.com/datasheet/2/40/AutoMLCC-777028.pdf> KEMET X7R Series <https://www.mouser.com/datasheet/2/212/KEM_C1002_X7R_SMD-1102033.pdf> Kyocera AVX <https://www.mouser.com/datasheet/2/40/C0GNP0_Dielectric-951274.pdf> GRM21BR61H <https://www.mouser.com/datasheet/2/281/1/GRM21BR61H106KE43_01A-1986884.pdf> C1812W104KDRACTU <https://www.mouser.com/datasheet/2/212/KEM_C1034_X7R_HV_ARC_SMD-1101730.pdf> CGA series - MLCC Automotive grade <https://product.tdk.com/system/files/dam/doc/product/capacitor/ceramic/mlcc/catalog/mlcc_automotive_general_en.pdf> TDK C Series Data Sheet <https://product.tdk.com/system/files/dam/doc/product/capacitor/ceramic/mlcc/catalog/mlcc_commercial_general_en.pdf> Kemet Datasheet <https://connect.kemet.com:7667/gateway/IntelliData-ComponentDocumentation/1.0/download/datasheet/C0603C220K3RACAUTO>; CAPACITANCE: 0.1µF; DKPN: 720-1688-1-ND; MANUFACTURER: Vishay Vitramon; MOPN: 77-VJ0603Y104JXQPBC; MPN: VJ0603Y104JXQPW1BC; TOLERANCE: 5%; VOLTAGE: 10V
C20 = HyTechDevices:CAPACITOR_?_*: Capacitor, Non-Polarized VJ...1BC Series Datasheet <https://www.mouser.com/datasheet/2/427/vjw1bcbascomseries-1762447.pdf> Samsung Datasheet <https://www.mouser.com/datasheet/2/585/MLCC-1837944.pdf> Samsung Automotive MLCC Datasheet <https://www.mouser.com/datasheet/2/585/MLCC_Automotive-1837966.pdf> Walsin Datasheet <https://www.mouser.com/datasheet/2/210/WTC_MLCC_General_Purpose-1534899.pdf> GRM188R61A226ME15D <https://www.mouser.com/datasheet/2/281/1/GRM188R61A226ME15_02A-1985787.pdf> GRM188R61E106MA73D <https://www.mouser.com/datasheet/2/281/1/GRM188R61E106MA73_01A-1985806.pdf> 885012006013 <https://www.mouser.com/datasheet/2/445/885012006013-1726946.pdf> 2220Y6300105KXTWS2 <https://www.mouser.com/datasheet/2/218/SMD_High_and_Std_StackiCap_P62-1825512.pdf> Yageo Class 2, X5R <https://www.mouser.com/datasheet/2/447/UPY_GPHC_X5R_4V_to_50V_26-1827097.pdf> TDK C Series <https://www.mouser.com/ProductDetail/TDK/C3216X5R1V226M160AC?qs=%2Fha2pyFadujbcx9jh7lYl%2F4NeMoXFhdc8AqVWNq4wW6M2y7zl6GzBuhgtI0ngznN> AVX Automotive MLCC <https://www.mouser.com/datasheet/2/40/AutoMLCC-777028.pdf> KEMET X7R Series <https://www.mouser.com/datasheet/2/212/KEM_C1002_X7R_SMD-1102033.pdf> Kyocera AVX <https://www.mouser.com/datasheet/2/40/C0GNP0_Dielectric-951274.pdf> GRM21BR61H <https://www.mouser.com/datasheet/2/281/1/GRM21BR61H106KE43_01A-1986884.pdf> C1812W104KDRACTU <https://www.mouser.com/datasheet/2/212/KEM_C1034_X7R_HV_ARC_SMD-1101730.pdf> CGA series - MLCC Automotive grade <https://product.tdk.com/system/files/dam/doc/product/capacitor/ceramic/mlcc/catalog/mlcc_automotive_general_en.pdf> TDK C Series Data Sheet <https://product.tdk.com/system/files/dam/doc/product/capacitor/ceramic/mlcc/catalog/mlcc_commercial_general_en.pdf> Kemet Datasheet <https://connect.kemet.com:7667/gateway/IntelliData-ComponentDocumentation/1.0/download/datasheet/C0603C220K3RACAUTO>; CAPACITANCE: 15pF; DKPN: 720-VJ0603A150FXQPW1BCCT-ND; MANUFACTURER: Vishay Vitramon; MOPN: 77-VJ0603A150FXQPBC; MPN: VJ0603A150FXQPW1BC; TOLERANCE: 1%; VOLTAGE: 10V
C22 = HyTechDevices:CAPACITOR_?_*: Capacitor, Non-Polarized VJ...1BC Series Datasheet <https://www.mouser.com/datasheet/2/427/vjw1bcbascomseries-1762447.pdf> Samsung Datasheet <https://www.mouser.com/datasheet/2/585/MLCC-1837944.pdf> Samsung Automotive MLCC Datasheet <https://www.mouser.com/datasheet/2/585/MLCC_Automotive-1837966.pdf> Walsin Datasheet <https://www.mouser.com/datasheet/2/210/WTC_MLCC_General_Purpose-1534899.pdf> GRM188R61A226ME15D <https://www.mouser.com/datasheet/2/281/1/GRM188R61A226ME15_02A-1985787.pdf> GRM188R61E106MA73D <https://www.mouser.com/datasheet/2/281/1/GRM188R61E106MA73_01A-1985806.pdf> 885012006013 <https://www.mouser.com/datasheet/2/445/885012006013-1726946.pdf> 2220Y6300105KXTWS2 <https://www.mouser.com/datasheet/2/218/SMD_High_and_Std_StackiCap_P62-1825512.pdf> Yageo Class 2, X5R <https://www.mouser.com/datasheet/2/447/UPY_GPHC_X5R_4V_to_50V_26-1827097.pdf> TDK C Series <https://www.mouser.com/ProductDetail/TDK/C3216X5R1V226M160AC?qs=%2Fha2pyFadujbcx9jh7lYl%2F4NeMoXFhdc8AqVWNq4wW6M2y7zl6GzBuhgtI0ngznN> AVX Automotive MLCC <https://www.mouser.com/datasheet/2/40/AutoMLCC-777028.pdf> KEMET X7R Series <https://www.mouser.com/datasheet/2/212/KEM_C1002_X7R_SMD-1102033.pdf> Kyocera AVX <https://www.mouser.com/datasheet/2/40/C0GNP0_Dielectric-951274.pdf> GRM21BR61H <https://www.mouser.com/datasheet/2/281/1/GRM21BR61H106KE43_01A-1986884.pdf> C1812W104KDRACTU <https://www.mouser.com/datasheet/2/212/KEM_C1034_X7R_HV_ARC_SMD-1101730.pdf> CGA series - MLCC Automotive grade <https://product.tdk.com/system/files/dam/doc/product/capacitor/ceramic/mlcc/catalog/mlcc_automotive_general_en.pdf> TDK C Series Data Sheet <https://product.tdk.com/system/files/dam/doc/product/capacitor/ceramic/mlcc/catalog/mlcc_commercial_general_en.pdf> Kemet Datasheet <https://connect.kemet.com:7667/gateway/IntelliData-ComponentDocumentation/1.0/download/datasheet/C0603C220K3RACAUTO>; CAPACITANCE: 0.47µF; DKPN: 445-6928-6-ND; MANUFACTURER: TDK Corporation; MOPN: 810-CGA3E1X7R1V474K; MPN: CGA3E1X7R1V474K080AC; TOLERANCE: 10%; VOLTAGE: 35V
J1 = HyTechDevices:CONNECTOR-8_?_*: 8 Pin Connector; DKPN: 1754-1026-ND; MANUFACTURER: Amphenol LTW; MOPN: 523-M12A08PMMPSF8001; MPN: M12A-08PMMP-SF8001
J2 = HyTechDevices:CONNECTOR-2_?_*: 2 Pin Connector; DKPN: WM14310CT-ND; MANUFACTURER: Molex; MOPN: 538-43650-0214; MPN: 0436500214
J3 = HyTechDevices:BINDER-M12-A_4_PIN; MANUFACTURER: Binder; MPN: BN86-0531-1120-00004
J4 = HyTechDevices:CONNECTOR-4_?_*: 4 Pin Connector; DKPN: WM1832CT-ND; MANUFACTURER: Molex; MOPN: 538-0430450411; MPN: 0430450411
JP1-JP4 = HyTechDevices:JUMPER_?_*: 2 Pin Connector; DKPN: 13-RC0603FR-130RLTR-ND; MANUFACTURER: YAGEO; MOPN: 603-RC0603FR-130RL; MPN: RC0603FR-130RL
R1 = HyTechDevices:RESISTOR_?_*: Resistor PWR163 Series <https://www.mouser.com/datasheet/2/54/pwr163-777985.pdf> AC Series <https://www.mouser.com/datasheet/2/447/Yageo_PYu_AC_51_RoHS_L_7_1714230-1874691.pdf> PU Series <https://www.mouser.com/datasheet/2/447/PYu-PU_51_RoHS_L_6-1504619.pdf> UCR Series <https://fscdn.rohm.com/en/products/databook/datasheet/passive/resistor/chip_resistor/ucr-e.pdf> ERA Series <https://www.mouser.com/datasheet/2/315/AOA0000C307-1149632.pdf> PWR263 Series <https://www.mouser.com/datasheet/2/54/pwr263s_35-778069.pdf> KTR Series <https://www.mouser.com/datasheet/2/348/ROHM_S_A0011075115_1-2563276.pdf> RC Series <https://www.mouser.com/datasheet/2/447/Yageo_03_18_2021_PYu_RC_Group_51_RoHS_L_11-2199992.pdf> ERJ Low Resistance Series <https://www.mouser.com/datasheet/2/315/AOA0000C313-1141758.pdf> ERJ PB3, PB6 Series <https://www.mouser.com/datasheet/2/315/AOA0000C328-1530132.pdf> ERJ UP3, UP6, UP8 Series <https://www.mouser.com/datasheet/2/315/Panasonic_Resistors_Thick_Film_Anti_Sulf_Anti_Surg-1825099.pdf> ERJ PA2, P03, PA3, P06, P08, P14 Series <https://www.mouser.com/datasheet/2/315/AOA0000C331-1141874.pdf> B20 Series <https://www.ohmite.com/assets/docs/res_200.pdf?r=false> TE Connectivity/Holsworthy RN73 Series <https://www.mouser.com/datasheet/2/418/4/NG_DS_1773270_M-604713.pdf> Vishay Dale D/CRCW e3 <https://www.mouser.com/datasheet/2/427/dcrcwe3-1762152.pdf> Ohmite B20 <https://www.ohmite.com/assets/docs/res_200.pdf?r=false>; DKPN: 1712-CPF-A-0603B1K0ETR-ND; MANUFACTURER: TE Connectivity Passive Product; MOPN: 279-CPF-A-0603B1K0E; MPN: CPF-A-0603B1K0E; POWER: 0.0625W; RESISTANCE: 1k; TOLERANCE: 0.1%; VOLTAGE_CONTINUOUS: 7.9V; VOLTAGE_MAX: 50V
R2 R13 = HyTechDevices:RESISTOR_?_*: Resistor PWR163 Series <https://www.mouser.com/datasheet/2/54/pwr163-777985.pdf> AC Series <https://www.mouser.com/datasheet/2/447/Yageo_PYu_AC_51_RoHS_L_7_1714230-1874691.pdf> PU Series <https://www.mouser.com/datasheet/2/447/PYu-PU_51_RoHS_L_6-1504619.pdf> UCR Series <https://fscdn.rohm.com/en/products/databook/datasheet/passive/resistor/chip_resistor/ucr-e.pdf> ERA Series <https://www.mouser.com/datasheet/2/315/AOA0000C307-1149632.pdf> PWR263 Series <https://www.mouser.com/datasheet/2/54/pwr263s_35-778069.pdf> KTR Series <https://www.mouser.com/datasheet/2/348/ROHM_S_A0011075115_1-2563276.pdf> RC Series <https://www.mouser.com/datasheet/2/447/Yageo_03_18_2021_PYu_RC_Group_51_RoHS_L_11-2199992.pdf> ERJ Low Resistance Series <https://www.mouser.com/datasheet/2/315/AOA0000C313-1141758.pdf> ERJ PB3, PB6 Series <https://www.mouser.com/datasheet/2/315/AOA0000C328-1530132.pdf> ERJ UP3, UP6, UP8 Series <https://www.mouser.com/datasheet/2/315/Panasonic_Resistors_Thick_Film_Anti_Sulf_Anti_Surg-1825099.pdf> ERJ PA2, P03, PA3, P06, P08, P14 Series <https://www.mouser.com/datasheet/2/315/AOA0000C331-1141874.pdf> B20 Series <https://www.ohmite.com/assets/docs/res_200.pdf?r=false> TE Connectivity/Holsworthy RN73 Series <https://www.mouser.com/datasheet/2/418/4/NG_DS_1773270_M-604713.pdf> Vishay Dale D/CRCW e3 <https://www.mouser.com/datasheet/2/427/dcrcwe3-1762152.pdf> Ohmite B20 <https://www.ohmite.com/assets/docs/res_200.pdf?r=false>; DKPN: P1.13KHCT-ND; MANUFACTURER: Panasonic Electronic Components; MOPN: 667-ERJ-3EKF1131V; MPN: ERJ-3EKF1131V; POWER: 0.1W; RESISTANCE: 1.13k; TOLERANCE: 1%; VOLTAGE_CONTINUOUS: 75V; VOLTAGE_MAX: 150V
R3 R6-R8 R14 = HyTechDevices:RESISTOR_?_*: Resistor PWR163 Series <https://www.mouser.com/datasheet/2/54/pwr163-777985.pdf> AC Series <https://www.mouser.com/datasheet/2/447/Yageo_PYu_AC_51_RoHS_L_7_1714230-1874691.pdf> PU Series <https://www.mouser.com/datasheet/2/447/PYu-PU_51_RoHS_L_6-1504619.pdf> UCR Series <https://fscdn.rohm.com/en/products/databook/datasheet/passive/resistor/chip_resistor/ucr-e.pdf> ERA Series <https://www.mouser.com/datasheet/2/315/AOA0000C307-1149632.pdf> PWR263 Series <https://www.mouser.com/datasheet/2/54/pwr263s_35-778069.pdf> KTR Series <https://www.mouser.com/datasheet/2/348/ROHM_S_A0011075115_1-2563276.pdf> RC Series <https://www.mouser.com/datasheet/2/447/Yageo_03_18_2021_PYu_RC_Group_51_RoHS_L_11-2199992.pdf> ERJ Low Resistance Series <https://www.mouser.com/datasheet/2/315/AOA0000C313-1141758.pdf> ERJ PB3, PB6 Series <https://www.mouser.com/datasheet/2/315/AOA0000C328-1530132.pdf> ERJ UP3, UP6, UP8 Series <https://www.mouser.com/datasheet/2/315/Panasonic_Resistors_Thick_Film_Anti_Sulf_Anti_Surg-1825099.pdf> ERJ PA2, P03, PA3, P06, P08, P14 Series <https://www.mouser.com/datasheet/2/315/AOA0000C331-1141874.pdf> B20 Series <https://www.ohmite.com/assets/docs/res_200.pdf?r=false> TE Connectivity/Holsworthy RN73 Series <https://www.mouser.com/datasheet/2/418/4/NG_DS_1773270_M-604713.pdf> Vishay Dale D/CRCW e3 <https://www.mouser.com/datasheet/2/427/dcrcwe3-1762152.pdf> Ohmite B20 <https://www.ohmite.com/assets/docs/res_200.pdf?r=false>; DKPN: 311-20.0KHRTR-ND; MANUFACTURER: Yageo; MOPN: 603-RC0603FR-0720KL; MPN: RC0603FR-0720KL; POWER: 0.1 W; RESISTANCE: 20k; TOLERANCE: 1%; VOLTAGE_CONTINUOUS: 44.72V; VOLTAGE_MAX: 75V
R4 = HyTechDevices:RESISTOR_?_*: Resistor PWR163 Series <https://www.mouser.com/datasheet/2/54/pwr163-777985.pdf> AC Series <https://www.mouser.com/datasheet/2/447/Yageo_PYu_AC_51_RoHS_L_7_1714230-1874691.pdf> PU Series <https://www.mouser.com/datasheet/2/447/PYu-PU_51_RoHS_L_6-1504619.pdf> UCR Series <https://fscdn.rohm.com/en/products/databook/datasheet/passive/resistor/chip_resistor/ucr-e.pdf> ERA Series <https://www.mouser.com/datasheet/2/315/AOA0000C307-1149632.pdf> PWR263 Series <https://www.mouser.com/datasheet/2/54/pwr263s_35-778069.pdf> KTR Series <https://www.mouser.com/datasheet/2/348/ROHM_S_A0011075115_1-2563276.pdf> RC Series <https://www.mouser.com/datasheet/2/447/Yageo_03_18_2021_PYu_RC_Group_51_RoHS_L_11-2199992.pdf> ERJ Low Resistance Series <https://www.mouser.com/datasheet/2/315/AOA0000C313-1141758.pdf> ERJ PB3, PB6 Series <https://www.mouser.com/datasheet/2/315/AOA0000C328-1530132.pdf> ERJ UP3, UP6, UP8 Series <https://www.mouser.com/datasheet/2/315/Panasonic_Resistors_Thick_Film_Anti_Sulf_Anti_Surg-1825099.pdf> ERJ PA2, P03, PA3, P06, P08, P14 Series <https://www.mouser.com/datasheet/2/315/AOA0000C331-1141874.pdf> B20 Series <https://www.ohmite.com/assets/docs/res_200.pdf?r=false> TE Connectivity/Holsworthy RN73 Series <https://www.mouser.com/datasheet/2/418/4/NG_DS_1773270_M-604713.pdf> Vishay Dale D/CRCW e3 <https://www.mouser.com/datasheet/2/427/dcrcwe3-1762152.pdf> Ohmite B20 <https://www.ohmite.com/assets/docs/res_200.pdf?r=false>; DKPN: P20020CT-ND; MANUFACTURER: Panasonic Electronic Components; MOPN: 667-ERJ-PB3B2741V; MPN: ERJ-PB3B2741V; POWER: 0.2W; RESISTANCE: 2.74k; TOLERANCE: 0.1%; VOLTAGE_CONTINUOUS: 23.41V; VOLTAGE_MAX: 150V
R5 R17 = HyTechDevices:RESISTOR_?_*: Resistor PWR163 Series <https://www.mouser.com/datasheet/2/54/pwr163-777985.pdf> AC Series <https://www.mouser.com/datasheet/2/447/Yageo_PYu_AC_51_RoHS_L_7_1714230-1874691.pdf> PU Series <https://www.mouser.com/datasheet/2/447/PYu-PU_51_RoHS_L_6-1504619.pdf> UCR Series <https://fscdn.rohm.com/en/products/databook/datasheet/passive/resistor/chip_resistor/ucr-e.pdf> ERA Series <https://www.mouser.com/datasheet/2/315/AOA0000C307-1149632.pdf> PWR263 Series <https://www.mouser.com/datasheet/2/54/pwr263s_35-778069.pdf> KTR Series <https://www.mouser.com/datasheet/2/348/ROHM_S_A0011075115_1-2563276.pdf> RC Series <https://www.mouser.com/datasheet/2/447/Yageo_03_18_2021_PYu_RC_Group_51_RoHS_L_11-2199992.pdf> ERJ Low Resistance Series <https://www.mouser.com/datasheet/2/315/AOA0000C313-1141758.pdf> ERJ PB3, PB6 Series <https://www.mouser.com/datasheet/2/315/AOA0000C328-1530132.pdf> ERJ UP3, UP6, UP8 Series <https://www.mouser.com/datasheet/2/315/Panasonic_Resistors_Thick_Film_Anti_Sulf_Anti_Surg-1825099.pdf> ERJ PA2, P03, PA3, P06, P08, P14 Series <https://www.mouser.com/datasheet/2/315/AOA0000C331-1141874.pdf> B20 Series <https://www.ohmite.com/assets/docs/res_200.pdf?r=false> TE Connectivity/Holsworthy RN73 Series <https://www.mouser.com/datasheet/2/418/4/NG_DS_1773270_M-604713.pdf> Vishay Dale D/CRCW e3 <https://www.mouser.com/datasheet/2/427/dcrcwe3-1762152.pdf> Ohmite B20 <https://www.ohmite.com/assets/docs/res_200.pdf?r=false>; DKPN: 311-1.50MHRCT-ND; MANUFACTURER: Yageo; MOPN: 603-RC0603FR-071M5L; MPN: RC0603FR-071M5L; POWER: 0.1W; RESISTANCE: 1.5M; TOLERANCE: 1%; VOLTAGE_CONTINUOUS: 75V; VOLTAGE_MAX: 75V
R9 = HyTechDevices:RESISTOR_?_*: Resistor PWR163 Series <https://www.mouser.com/datasheet/2/54/pwr163-777985.pdf> AC Series <https://www.mouser.com/datasheet/2/447/Yageo_PYu_AC_51_RoHS_L_7_1714230-1874691.pdf> PU Series <https://www.mouser.com/datasheet/2/447/PYu-PU_51_RoHS_L_6-1504619.pdf> UCR Series <https://fscdn.rohm.com/en/products/databook/datasheet/passive/resistor/chip_resistor/ucr-e.pdf> ERA Series <https://www.mouser.com/datasheet/2/315/AOA0000C307-1149632.pdf> PWR263 Series <https://www.mouser.com/datasheet/2/54/pwr263s_35-778069.pdf> KTR Series <https://www.mouser.com/datasheet/2/348/ROHM_S_A0011075115_1-2563276.pdf> RC Series <https://www.mouser.com/datasheet/2/447/Yageo_03_18_2021_PYu_RC_Group_51_RoHS_L_11-2199992.pdf> ERJ Low Resistance Series <https://www.mouser.com/datasheet/2/315/AOA0000C313-1141758.pdf> ERJ PB3, PB6 Series <https://www.mouser.com/datasheet/2/315/AOA0000C328-1530132.pdf> ERJ UP3, UP6, UP8 Series <https://www.mouser.com/datasheet/2/315/Panasonic_Resistors_Thick_Film_Anti_Sulf_Anti_Surg-1825099.pdf> ERJ PA2, P03, PA3, P06, P08, P14 Series <https://www.mouser.com/datasheet/2/315/AOA0000C331-1141874.pdf> B20 Series <https://www.ohmite.com/assets/docs/res_200.pdf?r=false> TE Connectivity/Holsworthy RN73 Series <https://www.mouser.com/datasheet/2/418/4/NG_DS_1773270_M-604713.pdf> Vishay Dale D/CRCW e3 <https://www.mouser.com/datasheet/2/427/dcrcwe3-1762152.pdf> Ohmite B20 <https://www.ohmite.com/assets/docs/res_200.pdf?r=false>; DKPN: P1.33KDBCT-ND; MANUFACTURER: Panasonic Electronic Components; MOPN: 667-ERA-3AEB1331V; MPN: ERA-3AEB1331V; POWER: 0.1W; RESISTANCE: 1.33k; TOLERANCE: 0.1%; VOLTAGE_CONTINUOUS: 11.53V; VOLTAGE_MAX: 75V
R10 = HyTechDevices:RESISTOR_?_*: Resistor PWR163 Series <https://www.mouser.com/datasheet/2/54/pwr163-777985.pdf> AC Series <https://www.mouser.com/datasheet/2/447/Yageo_PYu_AC_51_RoHS_L_7_1714230-1874691.pdf> PU Series <https://www.mouser.com/datasheet/2/447/PYu-PU_51_RoHS_L_6-1504619.pdf> UCR Series <https://fscdn.rohm.com/en/products/databook/datasheet/passive/resistor/chip_resistor/ucr-e.pdf> ERA Series <https://www.mouser.com/datasheet/2/315/AOA0000C307-1149632.pdf> PWR263 Series <https://www.mouser.com/datasheet/2/54/pwr263s_35-778069.pdf> KTR Series <https://www.mouser.com/datasheet/2/348/ROHM_S_A0011075115_1-2563276.pdf> RC Series <https://www.mouser.com/datasheet/2/447/Yageo_03_18_2021_PYu_RC_Group_51_RoHS_L_11-2199992.pdf> ERJ Low Resistance Series <https://www.mouser.com/datasheet/2/315/AOA0000C313-1141758.pdf> ERJ PB3, PB6 Series <https://www.mouser.com/datasheet/2/315/AOA0000C328-1530132.pdf> ERJ UP3, UP6, UP8 Series <https://www.mouser.com/datasheet/2/315/Panasonic_Resistors_Thick_Film_Anti_Sulf_Anti_Surg-1825099.pdf> ERJ PA2, P03, PA3, P06, P08, P14 Series <https://www.mouser.com/datasheet/2/315/AOA0000C331-1141874.pdf> B20 Series <https://www.ohmite.com/assets/docs/res_200.pdf?r=false> TE Connectivity/Holsworthy RN73 Series <https://www.mouser.com/datasheet/2/418/4/NG_DS_1773270_M-604713.pdf> Vishay Dale D/CRCW e3 <https://www.mouser.com/datasheet/2/427/dcrcwe3-1762152.pdf> Ohmite B20 <https://www.ohmite.com/assets/docs/res_200.pdf?r=false>; DKPN: P120DBCT-ND; MANUFACTURER: Panasonic Electronic Components; MOPN: 667-ERA-3AEB121V; MPN: ERA-3AEB121V; POWER: 0.1W; RESISTANCE: 120; TOLERANCE: 0.1%; VOLTAGE_CONTINUOUS: 3.46V; VOLTAGE_MAX: 75V
R11 = HyTechDevices:RESISTOR_?_*: Resistor PWR163 Series <https://www.mouser.com/datasheet/2/54/pwr163-777985.pdf> AC Series <https://www.mouser.com/datasheet/2/447/Yageo_PYu_AC_51_RoHS_L_7_1714230-1874691.pdf> PU Series <https://www.mouser.com/datasheet/2/447/PYu-PU_51_RoHS_L_6-1504619.pdf> UCR Series <https://fscdn.rohm.com/en/products/databook/datasheet/passive/resistor/chip_resistor/ucr-e.pdf> ERA Series <https://www.mouser.com/datasheet/2/315/AOA0000C307-1149632.pdf> PWR263 Series <https://www.mouser.com/datasheet/2/54/pwr263s_35-778069.pdf> KTR Series <https://www.mouser.com/datasheet/2/348/ROHM_S_A0011075115_1-2563276.pdf> RC Series <https://www.mouser.com/datasheet/2/447/Yageo_03_18_2021_PYu_RC_Group_51_RoHS_L_11-2199992.pdf> ERJ Low Resistance Series <https://www.mouser.com/datasheet/2/315/AOA0000C313-1141758.pdf> ERJ PB3, PB6 Series <https://www.mouser.com/datasheet/2/315/AOA0000C328-1530132.pdf> ERJ UP3, UP6, UP8 Series <https://www.mouser.com/datasheet/2/315/Panasonic_Resistors_Thick_Film_Anti_Sulf_Anti_Surg-1825099.pdf> ERJ PA2, P03, PA3, P06, P08, P14 Series <https://www.mouser.com/datasheet/2/315/AOA0000C331-1141874.pdf> B20 Series <https://www.ohmite.com/assets/docs/res_200.pdf?r=false> TE Connectivity/Holsworthy RN73 Series <https://www.mouser.com/datasheet/2/418/4/NG_DS_1773270_M-604713.pdf> Vishay Dale D/CRCW e3 <https://www.mouser.com/datasheet/2/427/dcrcwe3-1762152.pdf> Ohmite B20 <https://www.ohmite.com/assets/docs/res_200.pdf?r=false>; DKPN: 311-12.0KHRCT-ND; MANUFACTURER: Yageo; MOPN: 603-RC0603FR-0712KL; MPN: RC0603FR-0712KL; POWER: 0.1W; RESISTANCE: 12k; TOLERANCE: 1%; VOLTAGE_CONTINUOUS: 34.64V; VOLTAGE_MAX: 75V
R12 = HyTechDevices:RESISTOR_?_*: Resistor PWR163 Series <https://www.mouser.com/datasheet/2/54/pwr163-777985.pdf> AC Series <https://www.mouser.com/datasheet/2/447/Yageo_PYu_AC_51_RoHS_L_7_1714230-1874691.pdf> PU Series <https://www.mouser.com/datasheet/2/447/PYu-PU_51_RoHS_L_6-1504619.pdf> UCR Series <https://fscdn.rohm.com/en/products/databook/datasheet/passive/resistor/chip_resistor/ucr-e.pdf> ERA Series <https://www.mouser.com/datasheet/2/315/AOA0000C307-1149632.pdf> PWR263 Series <https://www.mouser.com/datasheet/2/54/pwr263s_35-778069.pdf> KTR Series <https://www.mouser.com/datasheet/2/348/ROHM_S_A0011075115_1-2563276.pdf> RC Series <https://www.mouser.com/datasheet/2/447/Yageo_03_18_2021_PYu_RC_Group_51_RoHS_L_11-2199992.pdf> ERJ Low Resistance Series <https://www.mouser.com/datasheet/2/315/AOA0000C313-1141758.pdf> ERJ PB3, PB6 Series <https://www.mouser.com/datasheet/2/315/AOA0000C328-1530132.pdf> ERJ UP3, UP6, UP8 Series <https://www.mouser.com/datasheet/2/315/Panasonic_Resistors_Thick_Film_Anti_Sulf_Anti_Surg-1825099.pdf> ERJ PA2, P03, PA3, P06, P08, P14 Series <https://www.mouser.com/datasheet/2/315/AOA0000C331-1141874.pdf> B20 Series <https://www.ohmite.com/assets/docs/res_200.pdf?r=false> TE Connectivity/Holsworthy RN73 Series <https://www.mouser.com/datasheet/2/418/4/NG_DS_1773270_M-604713.pdf> Vishay Dale D/CRCW e3 <https://www.mouser.com/datasheet/2/427/dcrcwe3-1762152.pdf> Ohmite B20 <https://www.ohmite.com/assets/docs/res_200.pdf?r=false>; DKPN: P20072CT-ND; MANUFACTURER: Panasonic Electronic Components; MOPN: 667-ERJ-PB3B7501V; MPN: ERJ-PB3B7501V; POWER: 0.2W; RESISTANCE: 7.5k; TOLERANCE: 0.1%; VOLTAGE_CONTINUOUS: 38.73V; VOLTAGE_MAX: 150V
R15 = HyTechDevices:RESISTOR_?_*: Resistor PWR163 Series <https://www.mouser.com/datasheet/2/54/pwr163-777985.pdf> AC Series <https://www.mouser.com/datasheet/2/447/Yageo_PYu_AC_51_RoHS_L_7_1714230-1874691.pdf> PU Series <https://www.mouser.com/datasheet/2/447/PYu-PU_51_RoHS_L_6-1504619.pdf> UCR Series <https://fscdn.rohm.com/en/products/databook/datasheet/passive/resistor/chip_resistor/ucr-e.pdf> ERA Series <https://www.mouser.com/datasheet/2/315/AOA0000C307-1149632.pdf> PWR263 Series <https://www.mouser.com/datasheet/2/54/pwr263s_35-778069.pdf> KTR Series <https://www.mouser.com/datasheet/2/348/ROHM_S_A0011075115_1-2563276.pdf> RC Series <https://www.mouser.com/datasheet/2/447/Yageo_03_18_2021_PYu_RC_Group_51_RoHS_L_11-2199992.pdf> ERJ Low Resistance Series <https://www.mouser.com/datasheet/2/315/AOA0000C313-1141758.pdf> ERJ PB3, PB6 Series <https://www.mouser.com/datasheet/2/315/AOA0000C328-1530132.pdf> ERJ UP3, UP6, UP8 Series <https://www.mouser.com/datasheet/2/315/Panasonic_Resistors_Thick_Film_Anti_Sulf_Anti_Surg-1825099.pdf> ERJ PA2, P03, PA3, P06, P08, P14 Series <https://www.mouser.com/datasheet/2/315/AOA0000C331-1141874.pdf> B20 Series <https://www.ohmite.com/assets/docs/res_200.pdf?r=false> TE Connectivity/Holsworthy RN73 Series <https://www.mouser.com/datasheet/2/418/4/NG_DS_1773270_M-604713.pdf> Vishay Dale D/CRCW e3 <https://www.mouser.com/datasheet/2/427/dcrcwe3-1762152.pdf> Ohmite B20 <https://www.ohmite.com/assets/docs/res_200.pdf?r=false>; RESISTANCE: DNP
R18 = HyTechDevices:RESISTOR_?_*: Resistor PWR163 Series <https://www.mouser.com/datasheet/2/54/pwr163-777985.pdf> AC Series <https://www.mouser.com/datasheet/2/447/Yageo_PYu_AC_51_RoHS_L_7_1714230-1874691.pdf> PU Series <https://www.mouser.com/datasheet/2/447/PYu-PU_51_RoHS_L_6-1504619.pdf> UCR Series <https://fscdn.rohm.com/en/products/databook/datasheet/passive/resistor/chip_resistor/ucr-e.pdf> ERA Series <https://www.mouser.com/datasheet/2/315/AOA0000C307-1149632.pdf> PWR263 Series <https://www.mouser.com/datasheet/2/54/pwr263s_35-778069.pdf> KTR Series <https://www.mouser.com/datasheet/2/348/ROHM_S_A0011075115_1-2563276.pdf> RC Series <https://www.mouser.com/datasheet/2/447/Yageo_03_18_2021_PYu_RC_Group_51_RoHS_L_11-2199992.pdf> ERJ Low Resistance Series <https://www.mouser.com/datasheet/2/315/AOA0000C313-1141758.pdf> ERJ PB3, PB6 Series <https://www.mouser.com/datasheet/2/315/AOA0000C328-1530132.pdf> ERJ UP3, UP6, UP8 Series <https://www.mouser.com/datasheet/2/315/Panasonic_Resistors_Thick_Film_Anti_Sulf_Anti_Surg-1825099.pdf> ERJ PA2, P03, PA3, P06, P08, P14 Series <https://www.mouser.com/datasheet/2/315/AOA0000C331-1141874.pdf> B20 Series <https://www.ohmite.com/assets/docs/res_200.pdf?r=false> TE Connectivity/Holsworthy RN73 Series <https://www.mouser.com/datasheet/2/418/4/NG_DS_1773270_M-604713.pdf> Vishay Dale D/CRCW e3 <https://www.mouser.com/datasheet/2/427/dcrcwe3-1762152.pdf> Ohmite B20 <https://www.ohmite.com/assets/docs/res_200.pdf?r=false>; DKPN: 311-1.24KHRCT-ND; MANUFACTURER: Yageo; MOPN: 603-RC0603FR-071K24L; MPN: RC0603FR-071K24L; POWER: 0.1W; RESISTANCE: 1.24k; TOLERANCE: 1%; VOLTAGE_CONTINUOUS: 11.14V; VOLTAGE_MAX: 75V
R19 = HyTechDevices:RESISTOR_?_*: Resistor PWR163 Series <https://www.mouser.com/datasheet/2/54/pwr163-777985.pdf> AC Series <https://www.mouser.com/datasheet/2/447/Yageo_PYu_AC_51_RoHS_L_7_1714230-1874691.pdf> PU Series <https://www.mouser.com/datasheet/2/447/PYu-PU_51_RoHS_L_6-1504619.pdf> UCR Series <https://fscdn.rohm.com/en/products/databook/datasheet/passive/resistor/chip_resistor/ucr-e.pdf> ERA Series <https://www.mouser.com/datasheet/2/315/AOA0000C307-1149632.pdf> PWR263 Series <https://www.mouser.com/datasheet/2/54/pwr263s_35-778069.pdf> KTR Series <https://www.mouser.com/datasheet/2/348/ROHM_S_A0011075115_1-2563276.pdf> RC Series <https://www.mouser.com/datasheet/2/447/Yageo_03_18_2021_PYu_RC_Group_51_RoHS_L_11-2199992.pdf> ERJ Low Resistance Series <https://www.mouser.com/datasheet/2/315/AOA0000C313-1141758.pdf> ERJ PB3, PB6 Series <https://www.mouser.com/datasheet/2/315/AOA0000C328-1530132.pdf> ERJ UP3, UP6, UP8 Series <https://www.mouser.com/datasheet/2/315/Panasonic_Resistors_Thick_Film_Anti_Sulf_Anti_Surg-1825099.pdf> ERJ PA2, P03, PA3, P06, P08, P14 Series <https://www.mouser.com/datasheet/2/315/AOA0000C331-1141874.pdf> B20 Series <https://www.ohmite.com/assets/docs/res_200.pdf?r=false> TE Connectivity/Holsworthy RN73 Series <https://www.mouser.com/datasheet/2/418/4/NG_DS_1773270_M-604713.pdf> Vishay Dale D/CRCW e3 <https://www.mouser.com/datasheet/2/427/dcrcwe3-1762152.pdf> Ohmite B20 <https://www.ohmite.com/assets/docs/res_200.pdf?r=false>; DKPN: P10KBDCT-ND; MANUFACTURER: Panasonic Electronic Components; MOPN: 667-ERA-3ARB103V; MPN: ERA-3ARB103V; POWER: 0.1W; RESISTANCE: 10k; TOLERANCE: 0.1%; VOLTAGE_CONTINUOUS: 31.62V; VOLTAGE_MAX: 75V
R22 = HyTechDevices:RESISTOR_?_*: Resistor PWR163 Series <https://www.mouser.com/datasheet/2/54/pwr163-777985.pdf> AC Series <https://www.mouser.com/datasheet/2/447/Yageo_PYu_AC_51_RoHS_L_7_1714230-1874691.pdf> PU Series <https://www.mouser.com/datasheet/2/447/PYu-PU_51_RoHS_L_6-1504619.pdf> UCR Series <https://fscdn.rohm.com/en/products/databook/datasheet/passive/resistor/chip_resistor/ucr-e.pdf> ERA Series <https://www.mouser.com/datasheet/2/315/AOA0000C307-1149632.pdf> PWR263 Series <https://www.mouser.com/datasheet/2/54/pwr263s_35-778069.pdf> KTR Series <https://www.mouser.com/datasheet/2/348/ROHM_S_A0011075115_1-2563276.pdf> RC Series <https://www.mouser.com/datasheet/2/447/Yageo_03_18_2021_PYu_RC_Group_51_RoHS_L_11-2199992.pdf> ERJ Low Resistance Series <https://www.mouser.com/datasheet/2/315/AOA0000C313-1141758.pdf> ERJ PB3, PB6 Series <https://www.mouser.com/datasheet/2/315/AOA0000C328-1530132.pdf> ERJ UP3, UP6, UP8 Series <https://www.mouser.com/datasheet/2/315/Panasonic_Resistors_Thick_Film_Anti_Sulf_Anti_Surg-1825099.pdf> ERJ PA2, P03, PA3, P06, P08, P14 Series <https://www.mouser.com/datasheet/2/315/AOA0000C331-1141874.pdf> B20 Series <https://www.ohmite.com/assets/docs/res_200.pdf?r=false> TE Connectivity/Holsworthy RN73 Series <https://www.mouser.com/datasheet/2/418/4/NG_DS_1773270_M-604713.pdf> Vishay Dale D/CRCW e3 <https://www.mouser.com/datasheet/2/427/dcrcwe3-1762152.pdf> Ohmite B20 <https://www.ohmite.com/assets/docs/res_200.pdf?r=false>; DKPN: 10-ERJ-UP3F2001VTR-ND; MANUFACTURER: Panasonic Electronic Components; MOPN: 667-ERJ-UP3F2001V; MPN: ERJ-UP3F2001V; POWER: 0.25W; RESISTANCE: 2k; TOLERANCE: 1%; VOLTAGE_CONTINUOUS: 22.36V; VOLTAGE_MAX: 150V
T1 = HyTechDevices:78613/3C: Murata 78613/3C Pulse Transformers 1CT:1 200 UH Datasheet <https://www.murata.com/products/productdata/8816046047262/kmp-786.pdf>; DKPN: 811-3726-ND; MANUFACTURER: Murata Power Solutions; MOPN: 580-786133C; MPN: 78613/3C
U1 U4 = HyTechDevices:OPAMP_2_CHANNEL_*: Op-Amp 2 Channel OPA2991 Datasheet <https://www.ti.com/lit/ds/symlink/opa2991.pdf?HQS=dis-mous-null-mousermode-dsf-pf-null-wwe&ts=1697521669896&ref_url=https%253A%252F%252Fwww.mouser.com%252F> Note: OPA2991 is also a comparator; DKPN: 296-OPA2991IDDFRCT-ND; MANUFACTURER: Texas Instruments; MOPN: 595-OPA2991IDDFR; MPN: OPA2991IDDFR
U3 = HyTechDevices:INA823*: INA823 Precision, Low-Power, Wide-Supply (2.7-V to 36-V) Instrumentation Amplifier Datasheet <https://www.ti.com/lit/ds/symlink/ina823.pdf?HQS=dis-mous-null-mousermode-dsf-pf-null-wwe&ts=1664732413637&ref_url=https%253A%252F%252Fwww.ti.com%252Fgeneral%252Fdocs%252Fsuppproductinfo.tsp%253FdistId%253D26%2526gotoUrl%253Dhttps%253A%252F%252Fwww.ti.com%252Flit%252Fgpn%252Fina823>; DKPN: 296-INA823DTCT-ND; MANUFACTURER: Texas Instruments; MOPN: 595-INA823DT; MPN: INA823DT
U6 = HyTechDevices:VOLTAGE_REFERENCE_?_*: MAX6173–MAX6177 Datasheet <https://www.mouser.com/datasheet/2/256/MAX6173-MAX6177-1515925.pdf>; DKPN: MAX6176AASA+-ND; MANUFACTURER: Maxim Integrated; MOPN: 700-MAX6176AASA; MPN: MAX6176AASA+
U7 = HyTechDevices:VOLTAGE_REGULATOR_?_*: Voltage Regulators LDL1117S50R Datasheet <https://www.mouser.com/datasheet/2/389/dm00366442-1799212.pdf> NCP785AH120T1G <https://www.mouser.com/datasheet/2/308/NCP785A_D-1812704.pdf> LMS8117A Datasheet <https://www.ti.com/lit/ds/symlink/lms8117a.pdf?HQS> ST732M50R Datasheet <https://www.mouser.com/datasheet/2/389/st732-1830546.pdf> LM2937IMPX-10/NOPB Datasheet <https://www.ti.com/lit/ds/symlink/lm2937.pdf> L78L15ACUTR Datasheet <https://www.mouser.com/datasheet/2/389/l78l-1849295.pdf>; DKPN: LMS8117AMP-3.3/NOPBCT-ND; MANUFACTURER: Texas Instruments; MOPN: 926-LMS8117AMP33NOPB; MPN: LMS8117AMP-3.3/NOPB
U10 = HyTechDevices:LTC6820: LTC6820 isoSPI Isolated Communications Interface Datasheet <mouser.com/datasheet/2/609/LTC6820-1601976.pdf>; MANUFACTURER: Analog Devices; MPN: LTC6820IMS#PBF
U11 = HyTechDevices:MCP3204: MCP3204 4-Channel ADC Datasheet <https://www.mouser.com/datasheet/2/268/21298c-68472.pdf>; DKPN: MCP3204-BI/SL-ND; MANUFACTURER: Microchip Technology; MOPN: 579-MCP3204-BI/SL; MPN: MCP3204-BI/SL

## Board
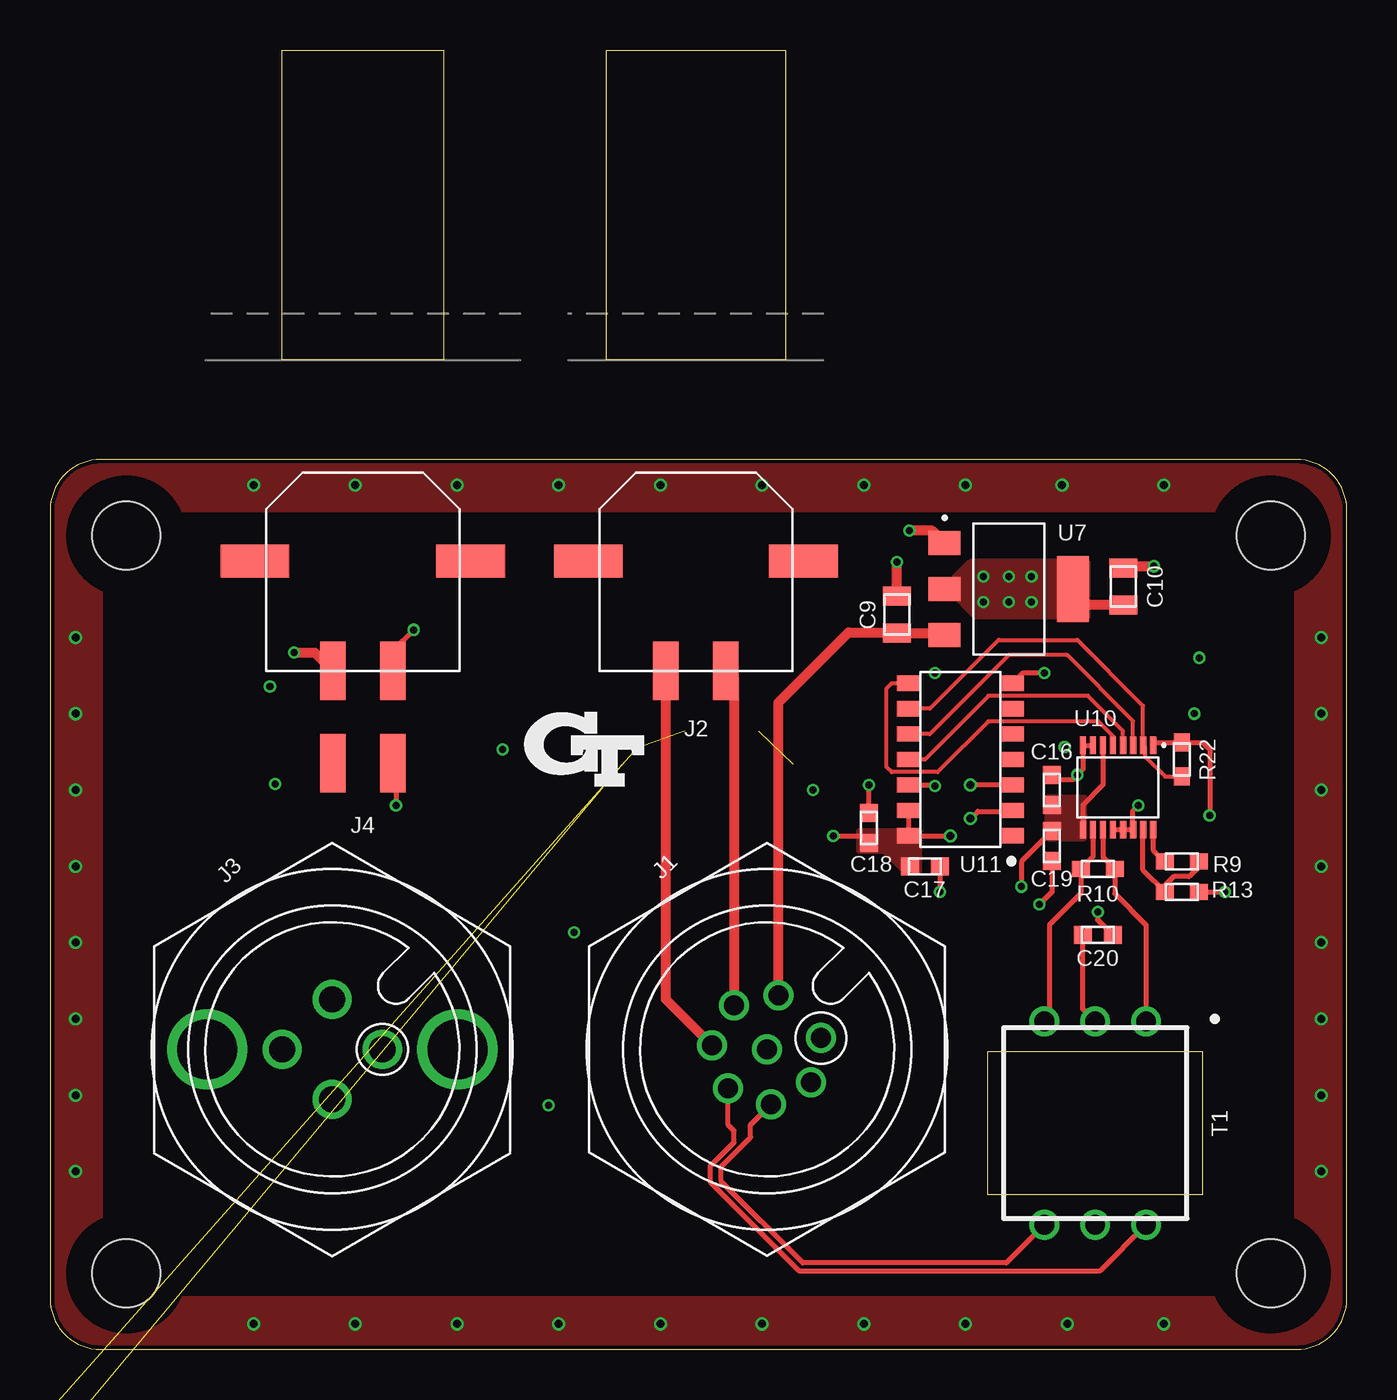
[diagram p3: board, top side]
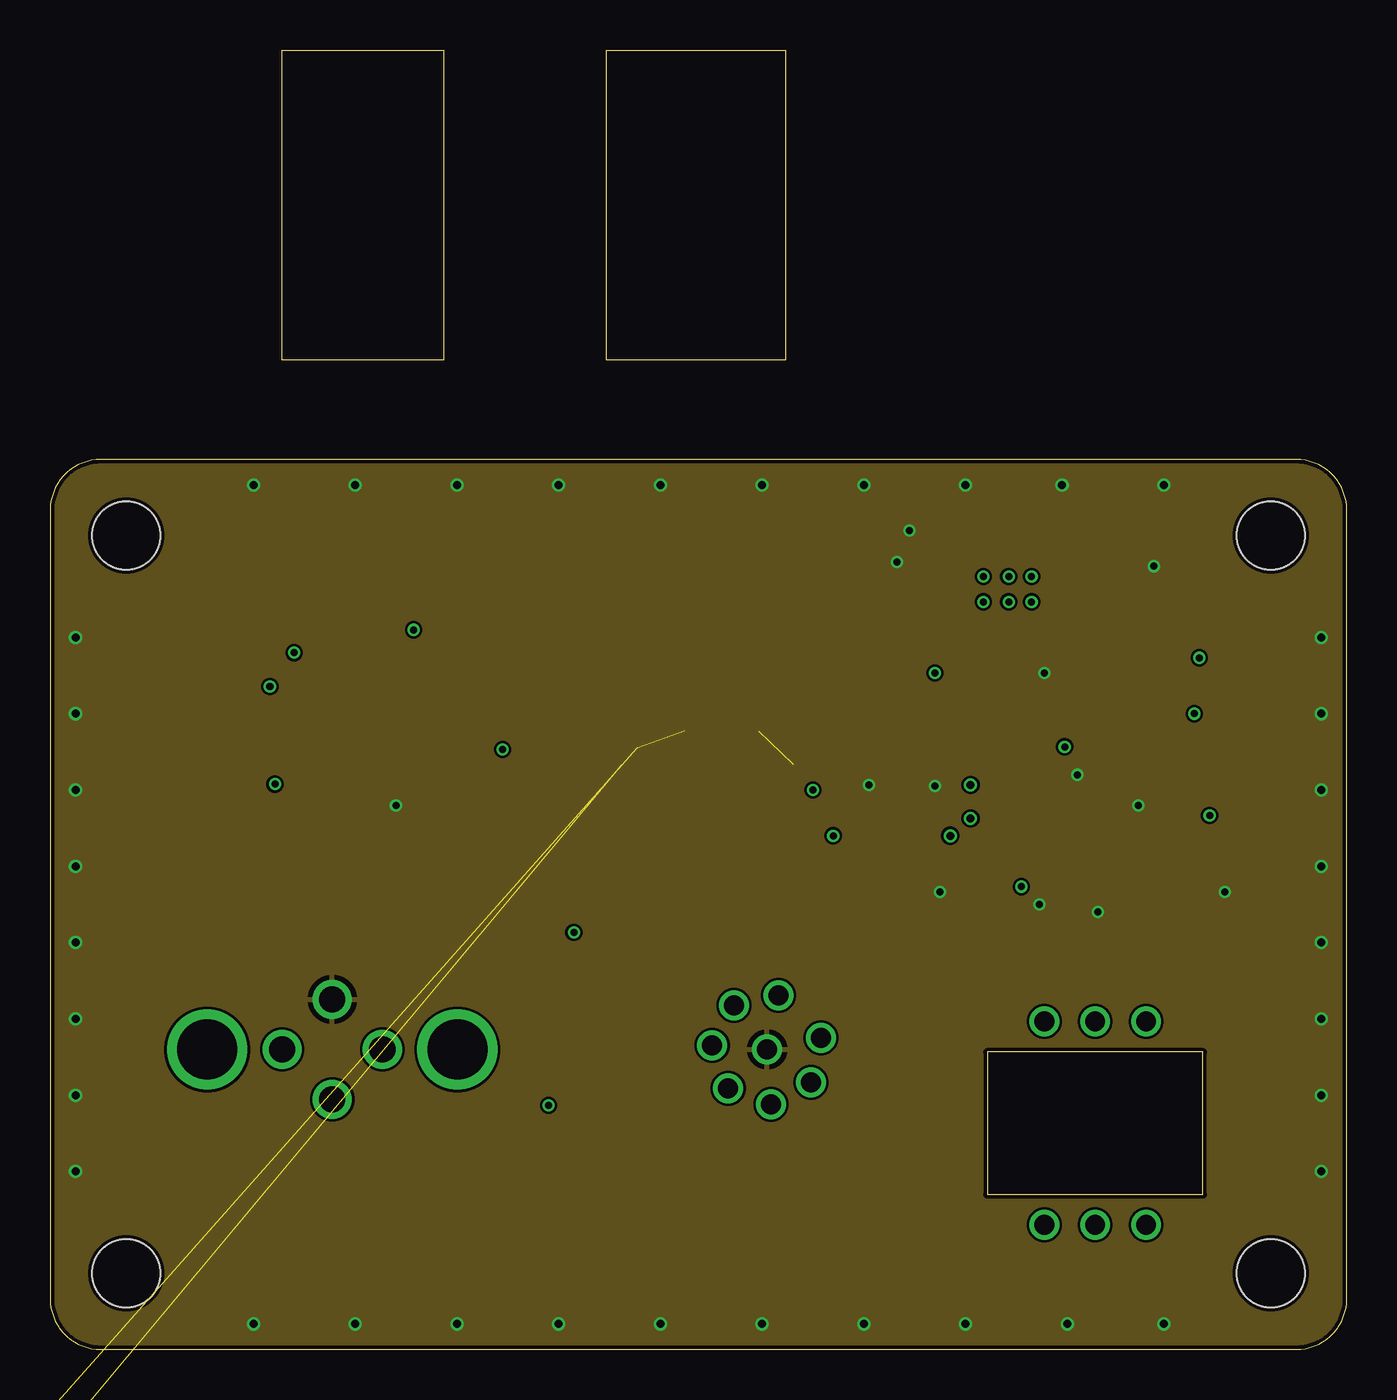
[diagram p4: board, inner layer Route2]
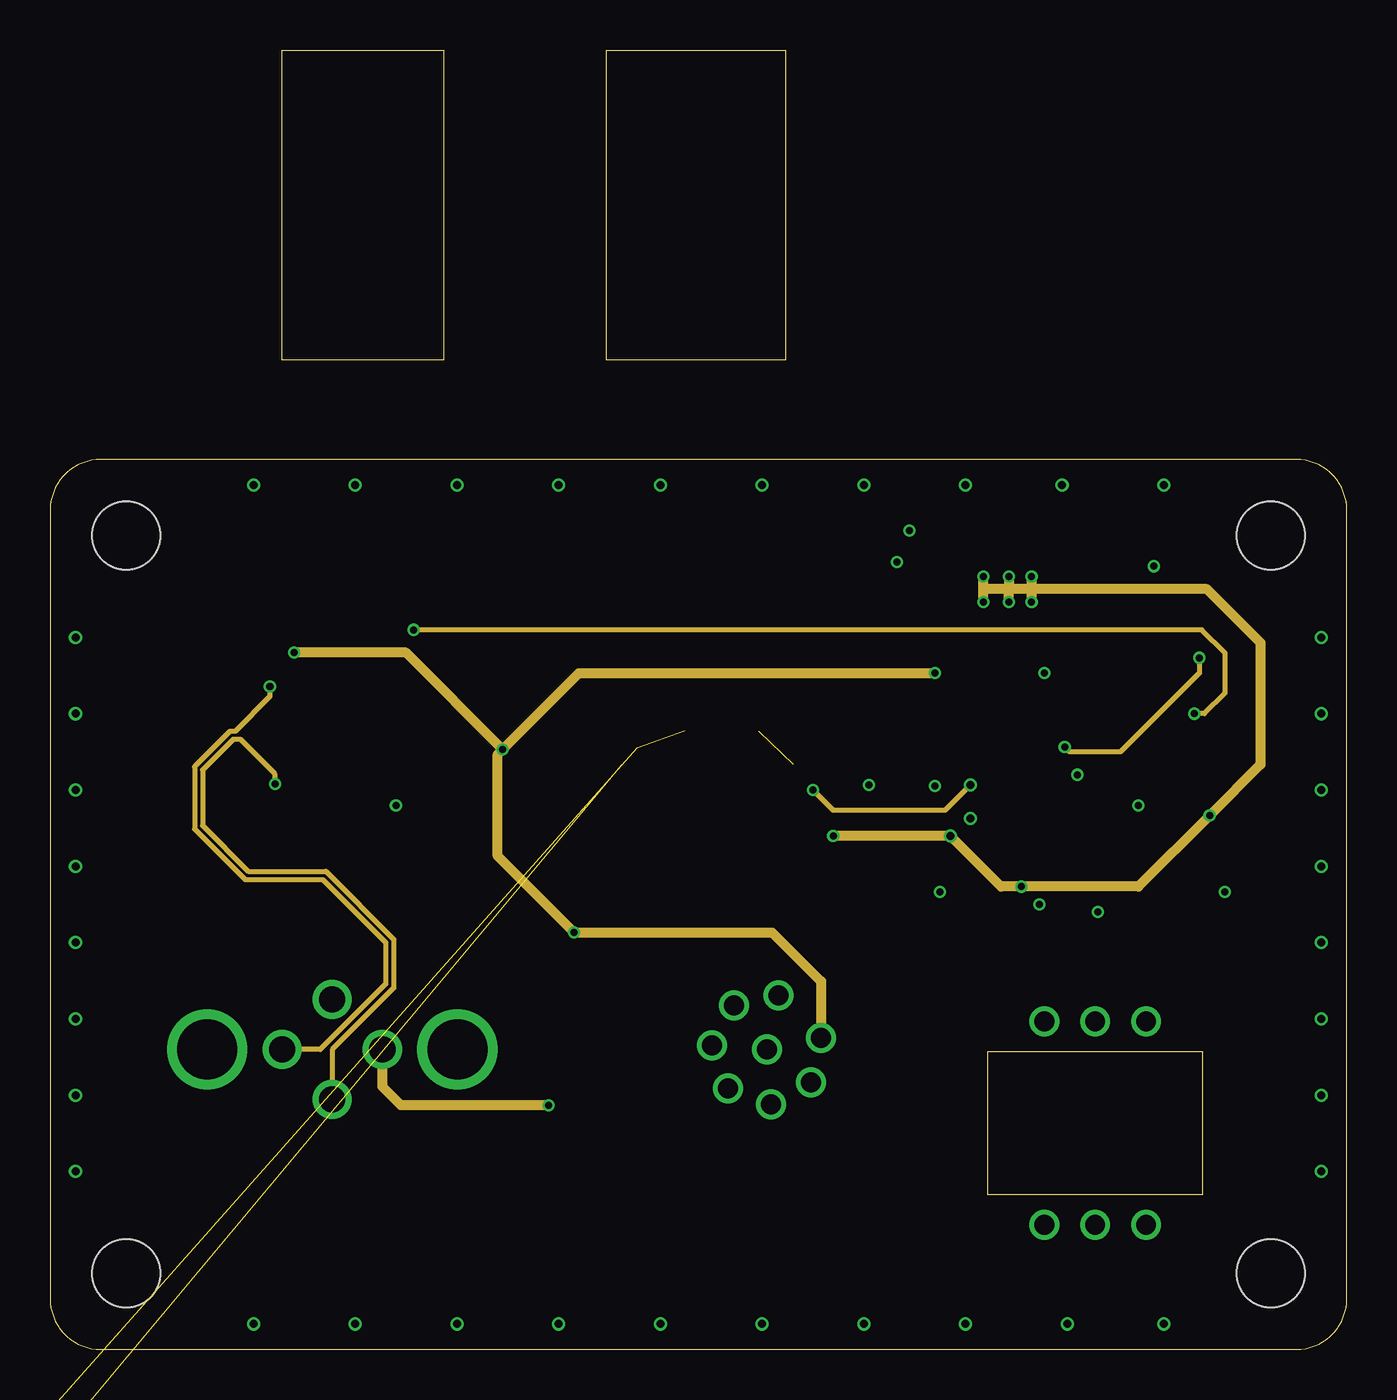
[diagram p5: board, inner layer Route15]
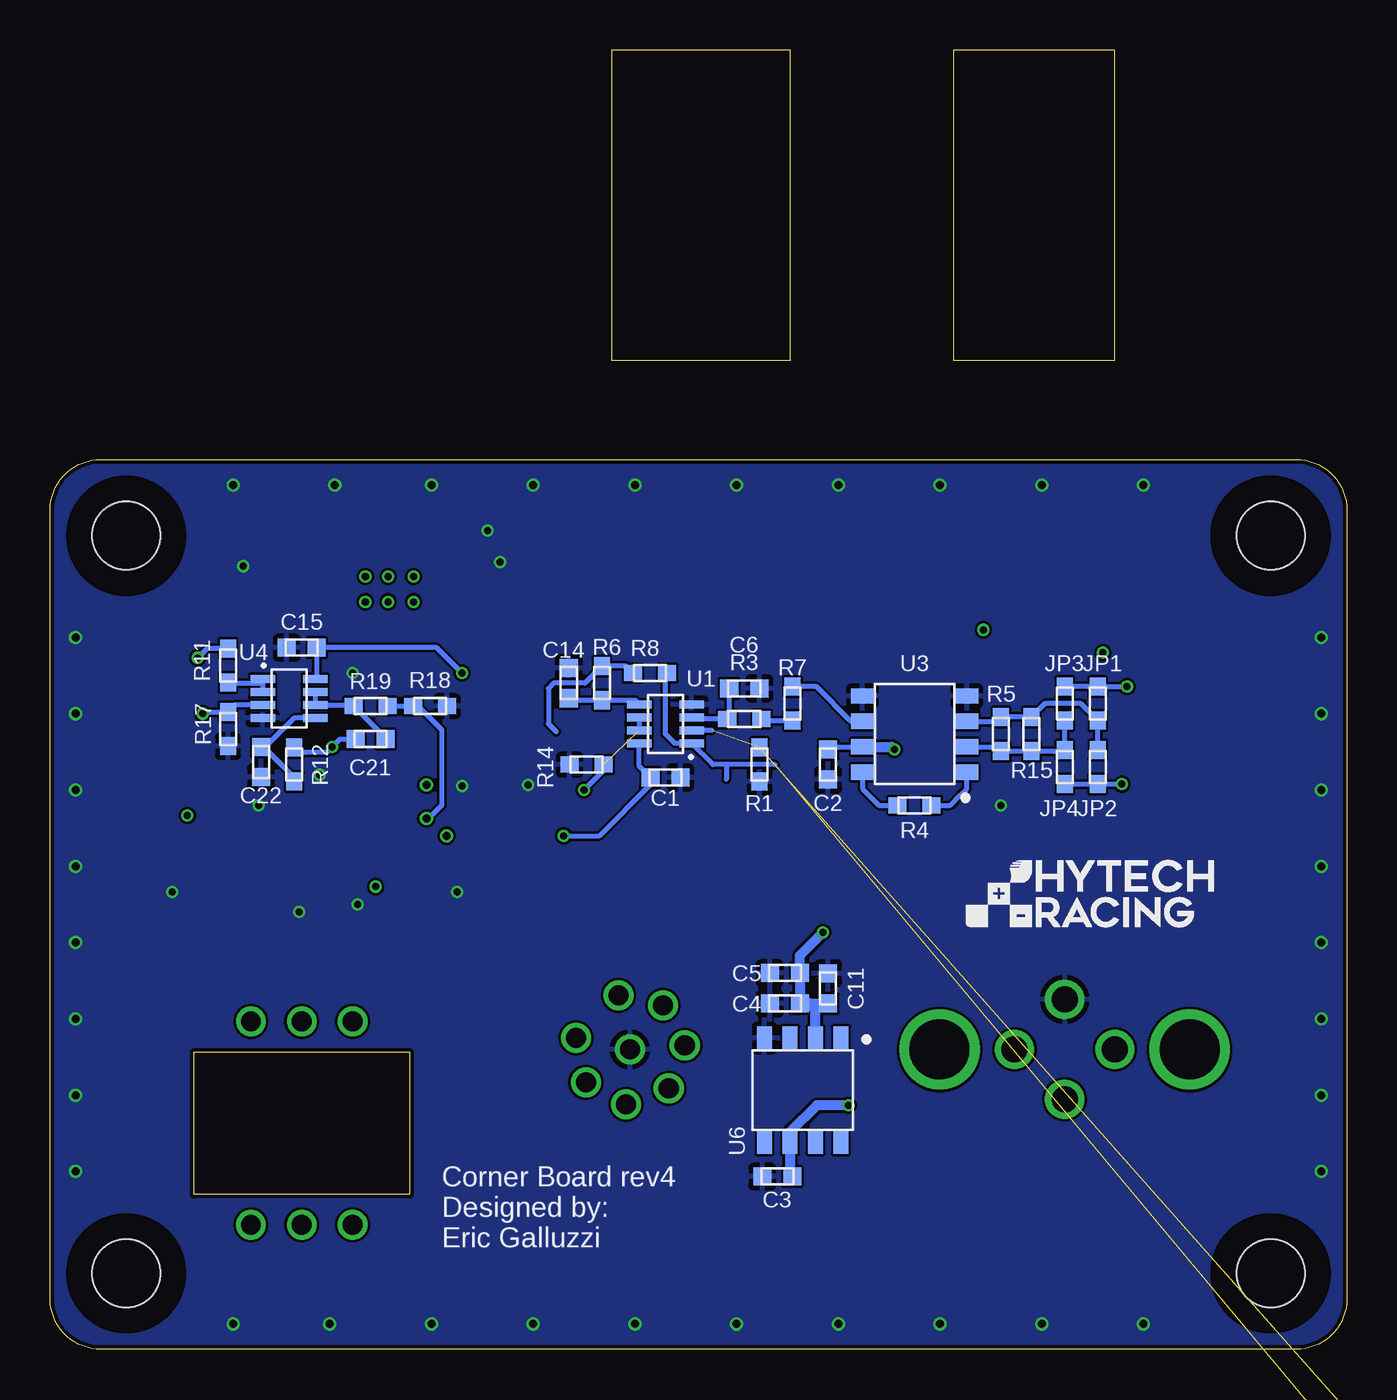
[diagram p6: board, bottom side, seen from below]

Size 64.77 x 44.45 mm. Coordinates in mm from the lower left corner, seen from the top.
Outline: 2.54,0 62.23,0 arc90 64.77,2.54 64.77,41.91 arc90 62.23,44.45 2.54,44.45 arc90 0,41.91 0,2.54 arc90 2.54,0
Copper layers (1+2*15+16): Top 0.035mm / dielectric 0.2mm / Route2 0.0175mm / dielectric 1.065mm / Route15 0.0175mm / dielectric 0.2mm / Bottom 0.035mm
Design rules "JLCPCB (4 Layer)": minimum track width 5mil, minimum drill 0.2mm, track to track 5mil, track to pad 5mil, pad to pad 5mil, via to via 20mil, smd to smd 5mil, copper to edge 0.2mm, drill to drill 21mil, minimum pad ring 6mil, minimum via ring 5mil, stop-mask expansion 2mil, vias tented up to drill 30mil, thermal gap 10mil

### Footprints (pad centres in the part's own frame; a part is rotated, then mirrored left to right if it is on the bottom)
0603-CAP = smd 0.9 x 0.9: 1 -0.75,0; 2 0.75,0
0805-CAP = smd 0.95 x 1.4: 1 -0.925,0; 2 0.925,0
M12A-08PMMP = drill 1: 1 2.69,0.572; 2 0.572,2.69; 3 -1.655,2.196; 4 -2.743,0.192; 5 -1.945,-1.945; 6 0.192,-2.743; 7 2.196,-1.655; 8 0,0
MOLEX_MICROFIT_SMD_RIGHTANGLE_02_SINGLE = smd 1.27 x 2.921: 1 1.499,5.474; 2 -1.499,5.474 | smd 3.429 x 1.651: PAD1 5.372,0; PAD2 -5.372,0
BINDER-86-0531-1120-00004M12 = drill 1.3: 1 1.768,1.768; 2 -1.768,1.768; 3 -1.768,-1.768; 4 1.768,-1.768 | drill 3: P$1 4.419,4.419; P$2 -4.419,-4.419
MOLEX_MICROFIT_SMD_RIGHTANGLE_04_DUAL = smd 1.27 x 2.921: 1 1.5,5.474; 2 -1.5,5.474; 3 1.5,10.097; 4 -1.5,10.097 | smd 3.429 x 1.651: PAD1 5.386,0; PAD2 -5.386,0
0603-RES = smd 0.9 x 0.8: 1 -0.85,0; 2 0.85,0
78613/3C_AIRGAP = drill 0.991 pad 1.2: 1 -5.08,2.54; 2 -5.08,0; 3 -5.08,-2.54; 4 5.08,-2.54; 5 5.08,0; 6 5.08,2.54
SOT-23-8 = smd 0.4 x 1.22: 1 -0.975,-1.31; 2 -0.325,-1.31; 3 0.325,-1.31; 4 0.975,-1.31; 5 0.975,1.31; 6 0.325,1.31; 7 -0.325,1.31; 8 -0.975,1.31
SOIC-08(NARROW,0.15") = smd 0.762 x 1.143: 1 -1.905,-2.603; 2 -0.635,-2.603; 3 0.635,-2.603; 4 1.905,-2.603; 5 1.905,2.603; 6 0.635,2.603; 7 -0.635,2.603; 8 -1.905,2.603
SOT-223 = smd 1.2 x 1.6: 1 -2.3,-3.2; 2 0,-3.2; 3 2.3,-3.2 | smd 3.3 x 1.6: 4 0,3.2
MSOP-16 = smd 0.305 x 0.889: 1 -1.75,-2.106; 2 -1.25,-2.106; 3 -0.75,-2.106; 4 -0.25,-2.106; 5 0.25,-2.106; 6 0.75,-2.106; 7 1.25,-2.106; 8 1.75,-2.106; 9 1.75,2.106; 10 1.25,2.106; 11 0.75,2.106; 12 0.25,2.106; 13 -0.25,2.106; 14 -0.75,2.106; 15 -1.25,2.106; 16 -1.75,2.106
SOIC-14 = smd 0.762 x 1.143: 1 -3.81,-2.603; 2 -2.54,-2.603; 3 -1.27,-2.603; 4 0,-2.603; 5 1.27,-2.603; 6 2.54,-2.603; 7 3.81,-2.603; 8 3.81,2.603; 9 2.54,2.603; 10 1.27,2.603; 11 0,2.603; 12 -1.27,2.603; 13 -2.54,2.603; 14 -3.81,2.603
MOUNTING_M3 = hole 3.4: 0,0

### Placement (x,y rotation side)
C1  34.04,28.57 0 bottom
C2  25.91,29.21 270 bottom
C3  28.45,8.64 180 bottom
C4  28.07,17.27 180 bottom
C5  28.07,18.8 180 bottom
C6  30.1,33.02 180 bottom
C9  42.29,36.7 90 top
C10  53.59,38.1 90 top
C11  25.91,18.03 90 bottom
C14  38.86,33.27 270 bottom
C15  52.2,35.05 180 bottom
C16  50.04,27.94 90 top
C17  43.69,24.13 0 top
C18  40.89,26.04 270 top
C19  50.04,25.15 90 top
C20  52.32,20.7 0 top
C21  48.77,30.48 180 bottom
C22  54.23,29.34 270 bottom
J1  35.81,14.99 0 top
J2  32.26,39.37 180 top
J3  14.1,14.99 315 top
J4  15.62,39.37 180 top
JP1  12.45,32.26 270 bottom
JP2  12.45,29.08 270 bottom
JP3  14.1,32.26 270 bottom
JP4  14.1,29.08 270 bottom
R1  29.34,29.21 90 bottom
R2  -0.51,-4.57 0 top  (outside the outline)
R3  30.1,31.5 180 bottom
R4  21.59,27.18 0 bottom
R5  17.27,30.73 90 bottom
R6  37.21,33.27 270 bottom
R7  27.69,32.26 270 bottom
R8  34.8,33.78 180 bottom
R9  56.52,24.38 0 top
R10  52.32,24 0 top
R11  55.88,34.16 90 bottom
R12  52.58,29.21 270 bottom
R13  56.52,22.86 0 top
R14  37.97,29.21 0 bottom
R15  15.75,30.73 90 bottom
R17  55.88,30.99 90 bottom
R18  45.8,32.13 0 bottom
R19  48.77,32.13 0 bottom
R22  56.52,29.46 90 top
T1  52.2,11.3 270 top
U1  34.04,31.24 90 bottom
U3  21.59,30.73 90 bottom
U4  52.83,32.51 270 bottom
U6  27.18,12.95 180 bottom
U7  47.88,37.97 270 top
U10  53.34,28.07 180 top
U11  45.47,29.46 90 top
U$1  [MOUNTING_M3]  3.81,3.81 0 top
U$2  [MOUNTING_M3]  60.96,3.81 0 top
U$3  [MOUNTING_M3]  60.96,40.64 0 top
U$4  [LOGO_HYTECH_SMALL]  19.05,21.08 0 bottom
U$6  [LOGO_GT_SMALL]  26.67,29.97 0 top
U$7  [MOUNTING_M3]  3.81,40.64 0 top

### Tracks (layer width: path | path; a pad name or v marks a point on that pad's centre or on a via)
10V  (via drill 0.35)
  Route15 0.508: J3.1 16.6,13.12 17.53,12.19 v24.89,12.19
  Bottom 0.254: 27.81,8.75 C3.1
  Bottom 0.508: 27.81,8.75 U6.6 27.81,10.86 26.48,12.19 v24.89,12.19
+3V3  (via drill 0.35, 0.4)
  Top 0.254: U10.1 55.23,30.31 R22.2 57.57,30.31 57.91,29.97 v57.91,26.67 | U10.9 51.59,27.21 52.59,28.21 U10.6 | U11.13 U11.14 v44.96,25.65 | C19.2 48.51,24.37 v48.51,23.11 | C10.1 53.34,37.17 | v39.12,25.65 40.52,25.65 C18.2
  Top 0.508: U7.4 51.88,37.17 53.34,37.17
  Route15 0.254: 39.37,25.65 v39.12,25.65
  Route15 0.508: 39.37,25.65 v44.96,25.65 47.5,23.11 v48.51,23.11 54.36,23.11 v57.91,26.67 60.45,29.21 60.45,35.31 57.78,37.97 49.02,37.97 | 49.02,37.97 v49.02,37.34 | v49.02,38.61 49.02,37.97 | 46.61,37.97 v46.61,38.61 | 49.02,37.97 47.88,37.97 | 47.88,37.97 46.61,37.97 | v46.61,37.34 46.61,37.97 | v47.88,37.34 47.88,37.97 | v47.88,38.61 47.88,37.97
  Bottom 0.254: U1.8 35.35,29.14 C1.1 34.79,28.21 37.34,25.65 v39.12,25.65
  pour Top (no thermals): 49.78,25.53 51.69,25.53 51.69,27.56 49.78,27.56
  pour Top (no thermals): 43.43,24.13 43.43,25.91 40.39,25.91 40.39,24.89 41.66,24.89 42.67,23.88 42.93,23.88 43.43,23.88
  pour Top (no thermals): 44.7,38.1 45.97,39.37 51.82,39.37 51.82,36.58 50.55,36.58 46.23,36.58 44.96,37.85
+5V
  Top 0.508: J1.2 36.39,32.32 37.72,33.66 39.88,35.81 42.26,35.81 C9.1 44.57,35.78 U7.3
+24V  (via drill 0.35)
  Top 0.508: v12.19,34.8 13.22,34.8 J4.1
  Route15 0.508: J1.1 38.5,18.39 36.07,20.83 v26.16,20.83 22.35,24.64 22.35,29.72 v22.61,29.97 | v22.61,29.97 26.42,33.78 v44.2,33.78 | v22.61,29.97 17.78,34.8 v12.19,34.8
  Bottom 0.254: C2.1 25.77,30.1 U3.7 | U4.8 51.45,33.56 C15.1 45.47,35.05 v44.2,33.78
  Bottom 0.508: 26.67,17.16 27.2,17.16 C4.1 C5.1 27.32,19.67 v26.16,20.83 | C11.1 26.8,17.28 26.67,17.16 | 26.67,17.16 26.54,17.03 U6.2 | U3.7 22.73,30.1 v22.61,29.97
ADC_CLK
  Top 0.203: U11.11 43.69,29.46 46.86,32.64 51.83,32.64 53.59,30.88 U10.4
ADC_CS
  Top 0.203: U11.8 42.04,33.27 41.78,33.02 41.78,29.08 42.04,28.83 44.32,28.83 46.86,31.37 52.35,31.37 53.09,30.63 U10.5
ADC_SDI
  Top 0.203: U11.9 43.94,32 47.37,35.43 51.3,35.43 54.59,32.15 U10.2 54.68,30.08 54.68,29.62 55.69,28.61 R22.1
ADC_SDO
  Top 0.203: U10.3 54.09,31.38 50.8,34.67 47.88,34.67 43.94,30.73 U11.10
DIFF_N
  Top 0.254: T1.4 47.75,4.32 37.59,4.32 33.51,8.4 33.51,9.12 34.99,10.59 34.99,11.22 J1.6
DIFF_P
  Top 0.254: T1.6 52.43,3.91 37.42,3.91 32.98,8.36 32.98,9.16 34.16,10.34 34.16,10.93 33.87,11.22 J1.5
GND  (via drill 0.35, 0.4)
  Top 0.254: C20.2 52.32,21.45 v52.32,21.84 | R13.2 v58.67,22.86 | U10.12 U10.13 U10.14 54.09,26.91 v54.36,27.18 | C16.2 50.28,28.45 51.05,28.45 v51.31,28.7 51.59,28.98 U10.8 U10.7 | v49.66,33.78 48.58,33.78 U11.7 | J4.4 17.27,29.12 v17.27,27.18 | C19.1 50.04,22.85 v49.41,22.22 | C18.1 v40.89,28.19 | U11.12 44.15,28.19 v44.2,28.15 | C17.2 44.45,24.12 v44.45,22.86
  Top 0.508: C10.2 53.69,39.12 v55.12,39.12 | C9.2 v42.29,39.32 | U7.1 44.06,40.89 v42.93,40.89
  other vias: 1.27,35.56 1.27,31.75 1.27,27.94 1.27,24.13 1.27,20.32 1.27,16.51 1.27,12.7 1.27,8.89 10.16,1.27 15.24,1.27 20.32,1.27 25.4,1.27 30.48,1.27 35.56,1.27 40.64,1.27 45.72,1.27 50.8,1.27 55.63,1.27 63.5,8.89 63.5,12.7 63.5,16.51 63.5,20.32 63.5,35.56 63.5,31.75 63.5,27.94 63.5,24.13 10.16,43.18 15.24,43.18 20.32,43.18 25.4,43.18 30.48,43.18 35.56,43.18 40.64,43.18 45.72,43.18 50.55,43.18 55.63,43.18
  pour Bottom: 66.04,45.72 66.04,-1.27 -1.27,-1.27 -1.27,45.72
  pour Route2: 67.31,46.99 67.31,-2.54 -2.54,-2.54 -2.54,46.99
  pour Top: 0,44.45 0,0 2.54,0 2.54,44.45
  pour Top: 2.54,44.45 64.77,44.45 64.77,41.91 2.54,41.91
  pour Top: 64.77,41.91 62.23,41.91 62.23,2.54 2.54,2.54 2.54,0 64.77,0
LOAD_CELL_AMPLIFIED  (1 unrouted)
  Bottom 0.254: 28.56,29.21 30.99,29.21 | 30.99,29.21 31.67,29.21 U1.1 33.57,30.27 34.04,30.73 34.04,33.69 R8.1 | 30.99,29.21 30.99,28.49
LOAD_CELL_FILTERED  (via drill 0.35, 0.4)  (1 unrouted)
  Top 0.254: U11.3 v45.97,28.19
  Route15 0.254: v45.97,28.19 44.7,26.92 39.12,26.92 v38.1,27.94
  Bottom 0.254: 37.22,29.31 R14.2 37.12,28.92 v38.1,27.94 | U1.6 U1.7 35.4,30.86
LOAD_CELL_POST_INA
  Bottom 0.254: U3.6 24.77,31.37 26.5,33.11 R7.1
N$1  (2 unrouted)
  Bottom 0.254: 31.72,30.92 U1.2
N$2
  Bottom 0.254: R4.2 19.81,27.18 19.3,27.69 18.99,28 U3.1
N$3
  Bottom 0.254: R3.1 29.16,31.41 R7.2
N$4
  Bottom 0.254: U3.8 24.19,28 23.37,27.18 R4.1
N$6
  Bottom 0.254: U1.3 32.66,31.5 R3.2 30.85,31.6 C6.2
N$7
  Bottom 0.254: U3.2 17.49,30.1 R5.1 R15.1 14.15,29.88 JP4.1 JP3.2
N$8
  Bottom 0.254: 39.5,30.86 39.88,31.24 39.88,33.02 39.62,33.27 38.06,33.27 R6.1 35.99,34.12 R8.2
N$9
  Bottom 0.254: U3.3 17.49,31.37 R5.2 R15.2 15.07,32.26 13.3,32.26 JP1.2 JP2.1
N$10
  Bottom 0.254: C14.2 38.76,32.42 R6.2 35.55,32.42 U1.5
N$14
  Top 0.254: T1.2 51.57,17.01 C20.1
N$16
  Top 0.254: U10.16 55.09,24.96 R9.1
N$17
  Top 0.254: U10.15 54.59,23.93 R13.1 55.71,22.86 55.71,23.2 56.13,23.62 56.9,23.62 57.37,24.09 R9.2
N$22
  Bottom 0.254: U4.7 U4.6 49.82,32.19 49.74,32.26 R19.1 48.02,30.53 C21.1
N$49
  Bottom 0.254: 54.1,30.09 54.03,30.09 52.58,31.54 U4.5 | 54.1,30.09 C22.1 | R12.2 52.58,28.56 54.1,30.09
N$53  (via drill 0.35)
  Route15 0.254: v57.4,34.54 57.4,33.78 53.47,29.84 50.93,29.84 v50.67,30.1
  Bottom 0.254: C21.2 50.29,30.48 v50.67,30.1 50.93,29.84 52.36,29.84 R12.1 | v57.4,34.54 56.94,35.01 R11.2
OUT_N
  Top 0.254: U10.10 52.09,24.62 R10.1 51.47,22.77 49.91,21.21 49.91,16.64 T1.3
OUT_P
  Top 0.254: U10.11 52.59,24.59 R10.2 53.17,22.77 54.74,21.21 T1.1
POSTINTERLOCK
  Top 0.508: J1.4 30.76,17.49 J2.1
PREINTERLOCK
  Top 0.508: J2.2 34.16,33.49 34.16,29.21 J1.3
SIGNAL_N  (via drill 0.35)
  Route15 0.254: v11.23,28.23 11.23,28.74 9.51,30.47 9.14,30.47 7.62,28.94 7.62,26.16 9.91,23.88 13.78,23.88 17.17,20.49 17.17,18.05 14.1,14.97 J3.4
  Bottom 0.254: v11.23,28.23 JP2.2 JP4.2
SIGNAL_P  (via drill 0.35)
  Route15 0.254: v10.98,33.11 10.98,32.6 9.25,30.87 8.98,30.87 7.21,29.11 7.21,25.99 9.74,23.47 13.61,23.47 16.76,20.32 16.76,18.25 13.5,14.99 J3.3
  Bottom 0.254: v10.98,33.11 JP1.1 JP3.1
SUS_POT_1  (via drill 0.35)
  Top 0.254: J4.2 17.12,34.9 v18.16,35.94
  Route15 0.254: v18.16,35.94 57.53,35.94 58.67,34.8 58.67,32.77 57.66,31.75 v57.15,31.75
  Bottom 0.254: v57.15,31.75 57.06,31.84 R17.2 55.53,32.19 U4.3
SUS_POT_1_3V3  (via drill 0.4)
  Top 0.254: U11.2 48.02,26.88 46.34,26.88 v45.97,26.51
  Bottom 0.254: v45.97,26.51 45.88,26.51 45.21,27.18 45.21,30.95 46.39,32.13 R18.1 R19.2
SUS_POT_1_24V1
  Bottom 0.254: U4.1 54.14,33.27 | 54.14,33.27 U4.2 | R11.1 55.84,33.27 54.14,33.27

### Text on the board
bPlace: Corner Board rev4 / Designed by: / Eric Galluzzi